# EAGLE schematic serv_open8_tsmc (EAGLE 9.6.2)
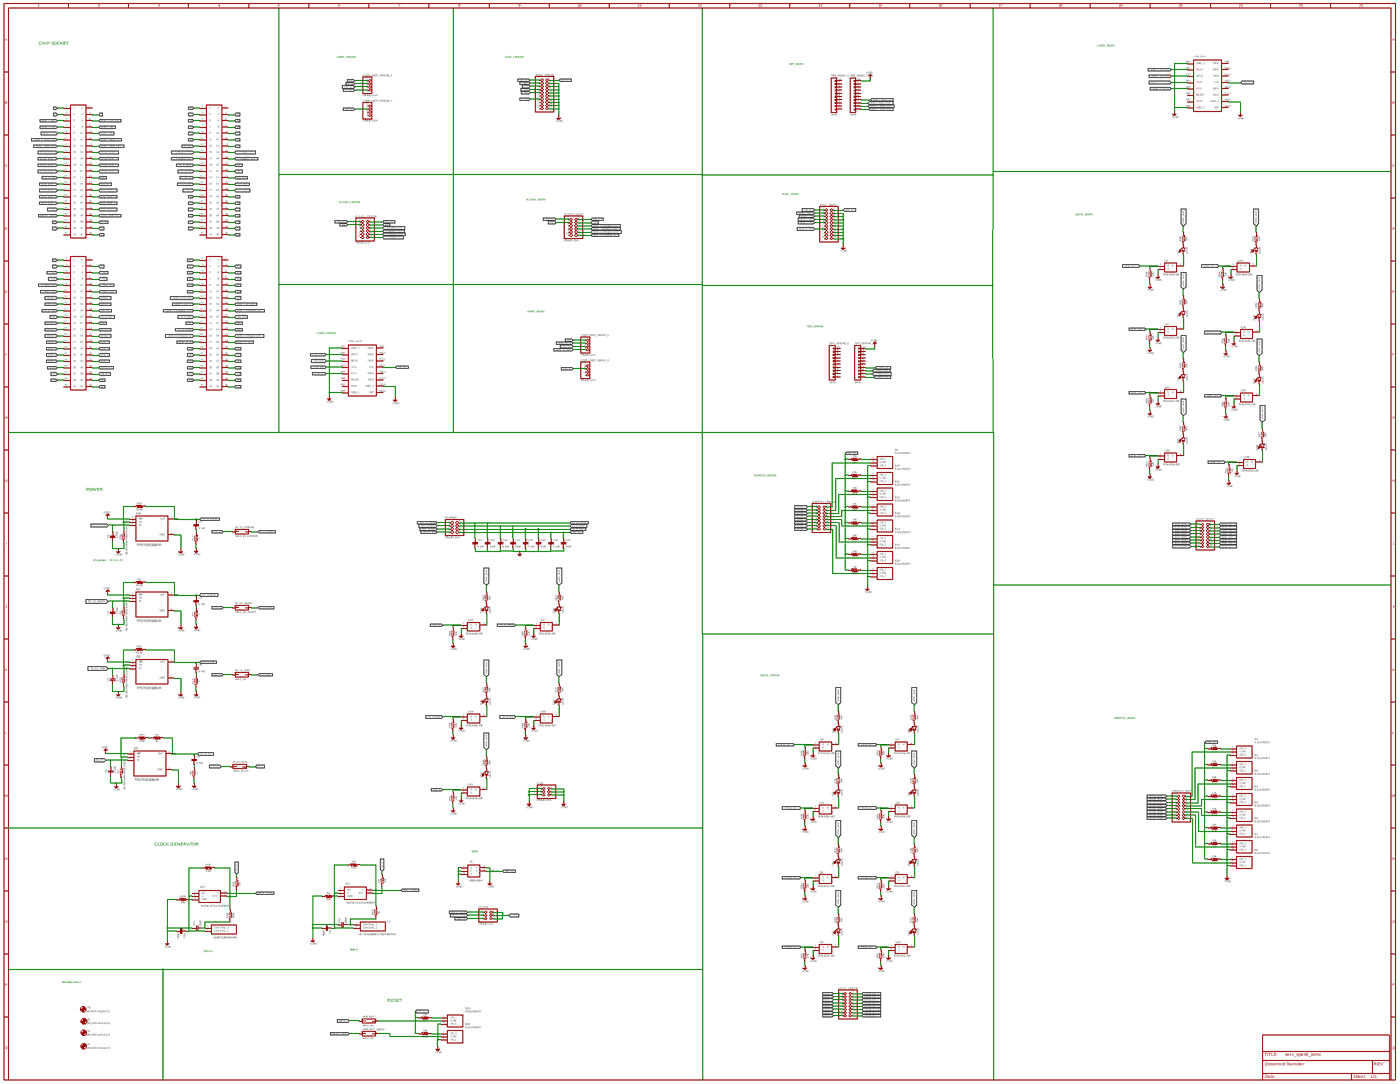
[diagram p0: schematic, sheet 1, overview]
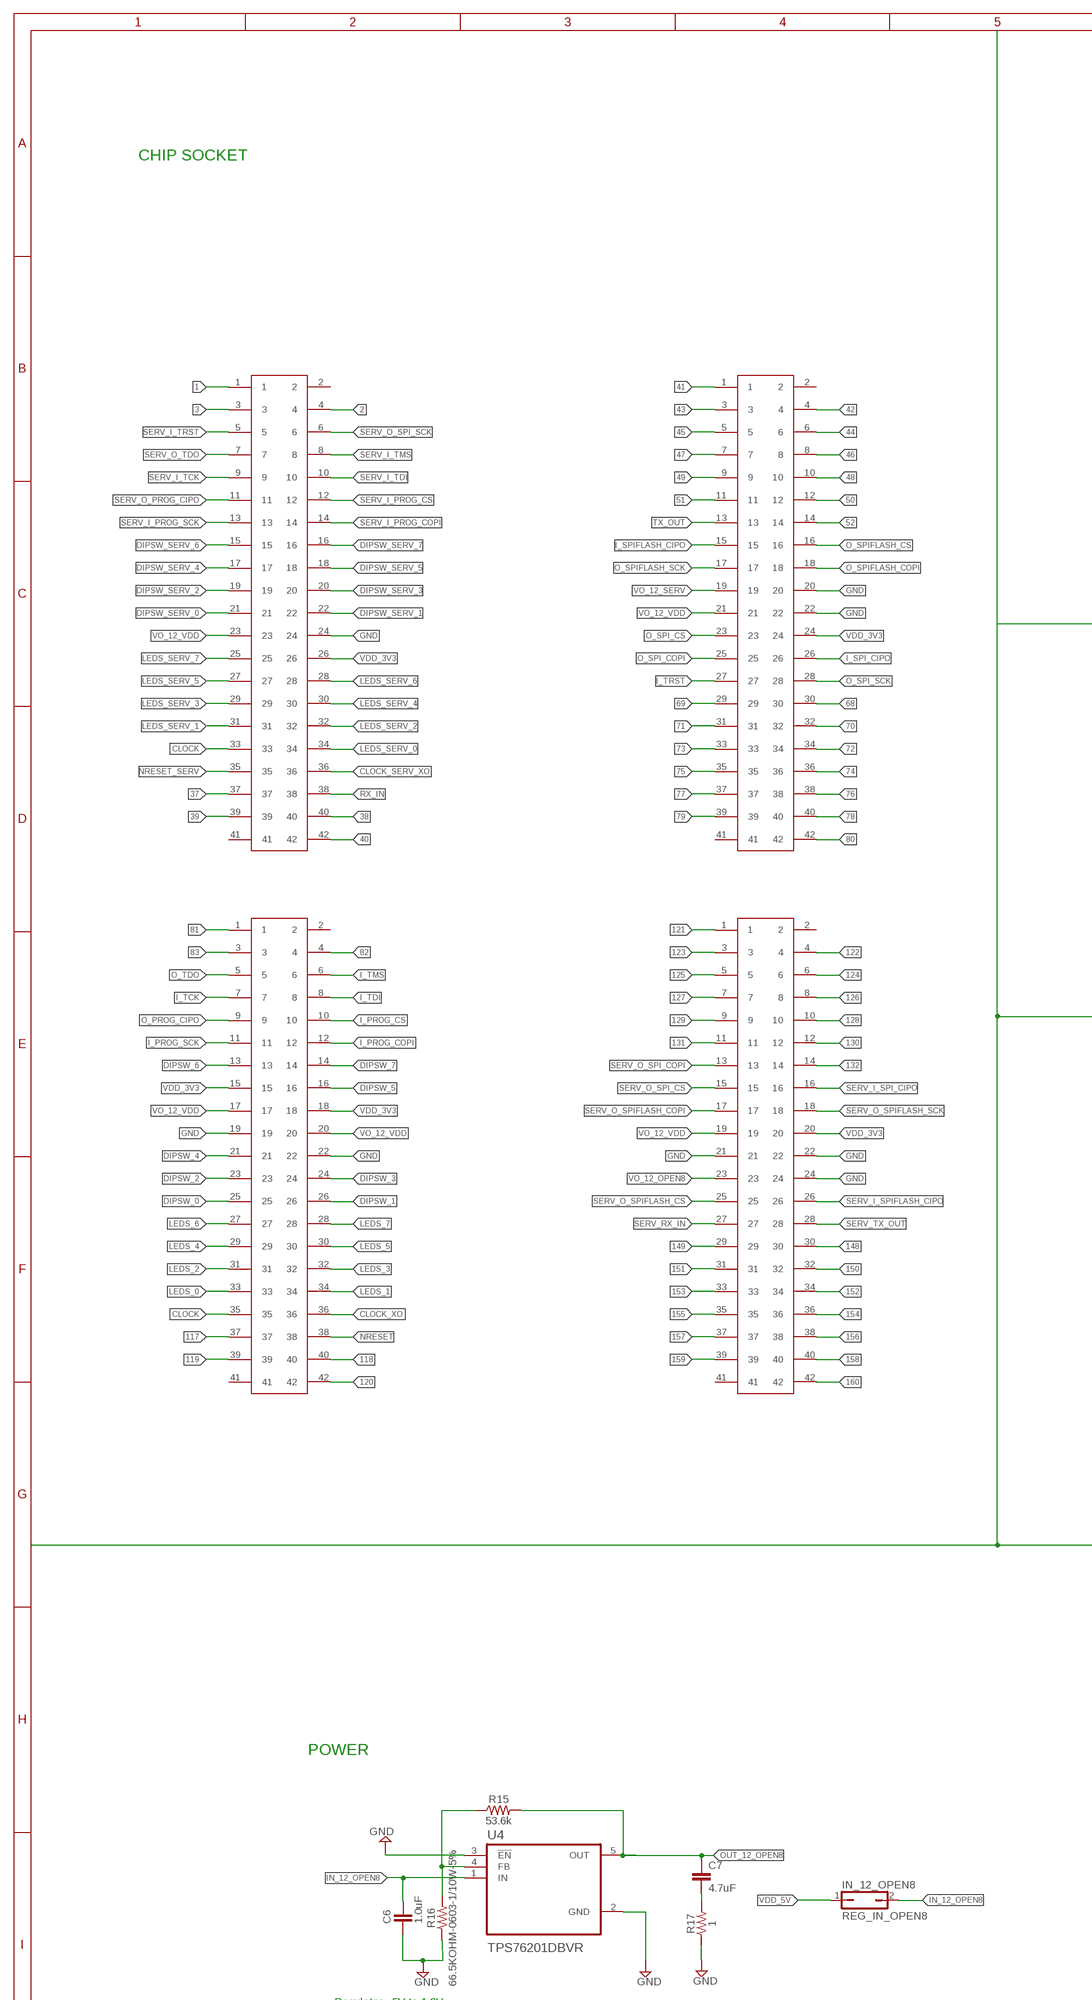
[diagram p1: schematic, sheet 1, part 1 of 8]
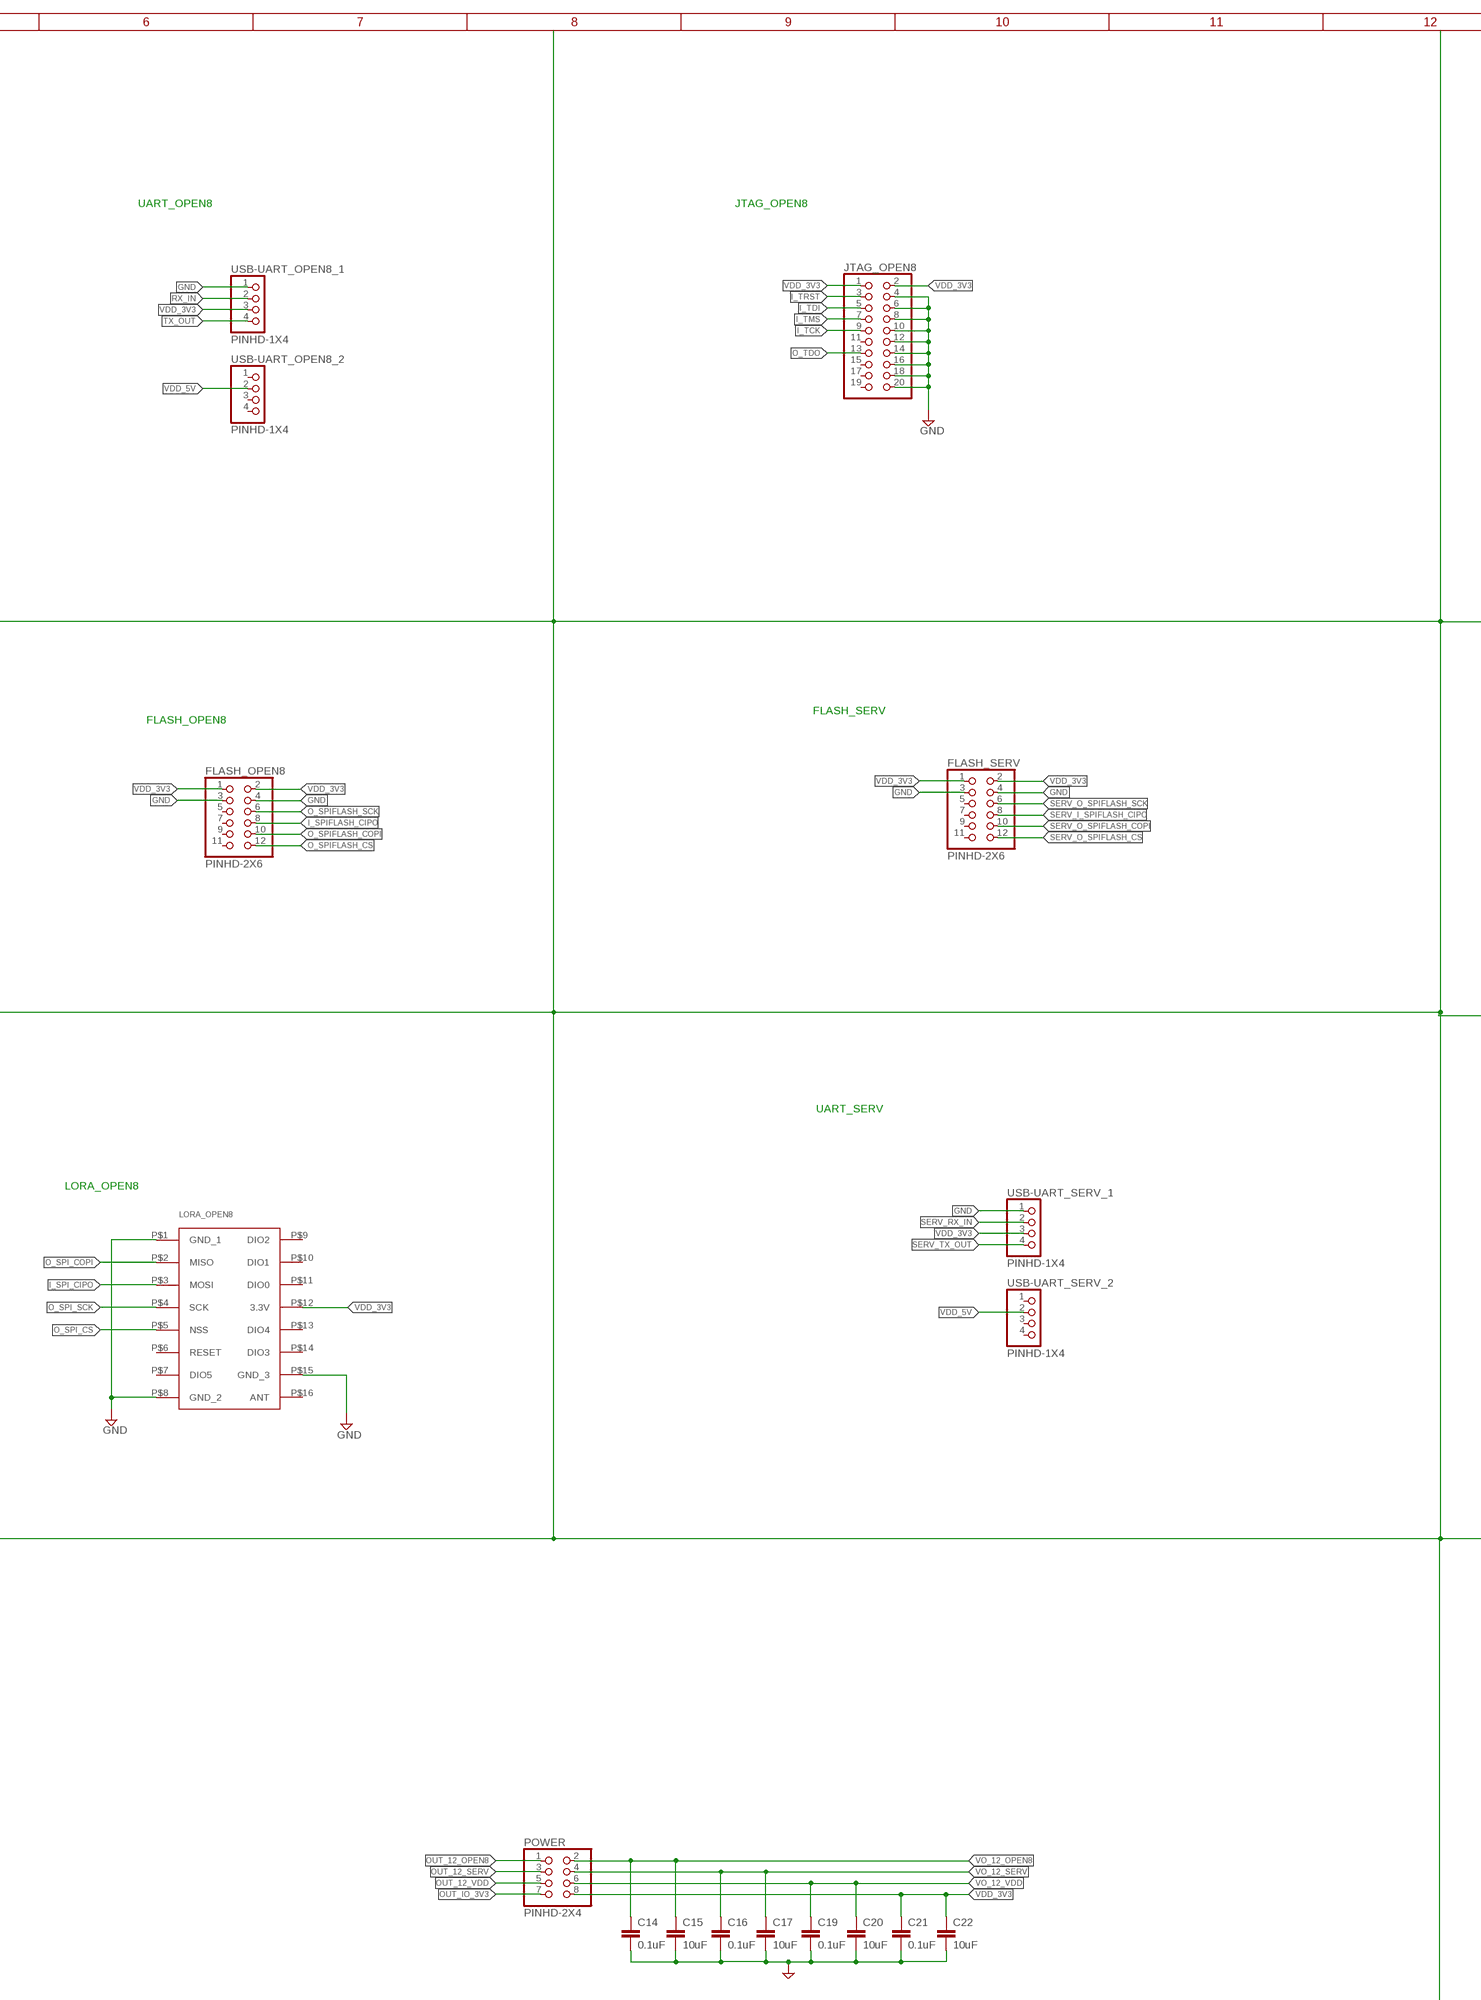
[diagram p2: schematic, sheet 1, part 2 of 8]
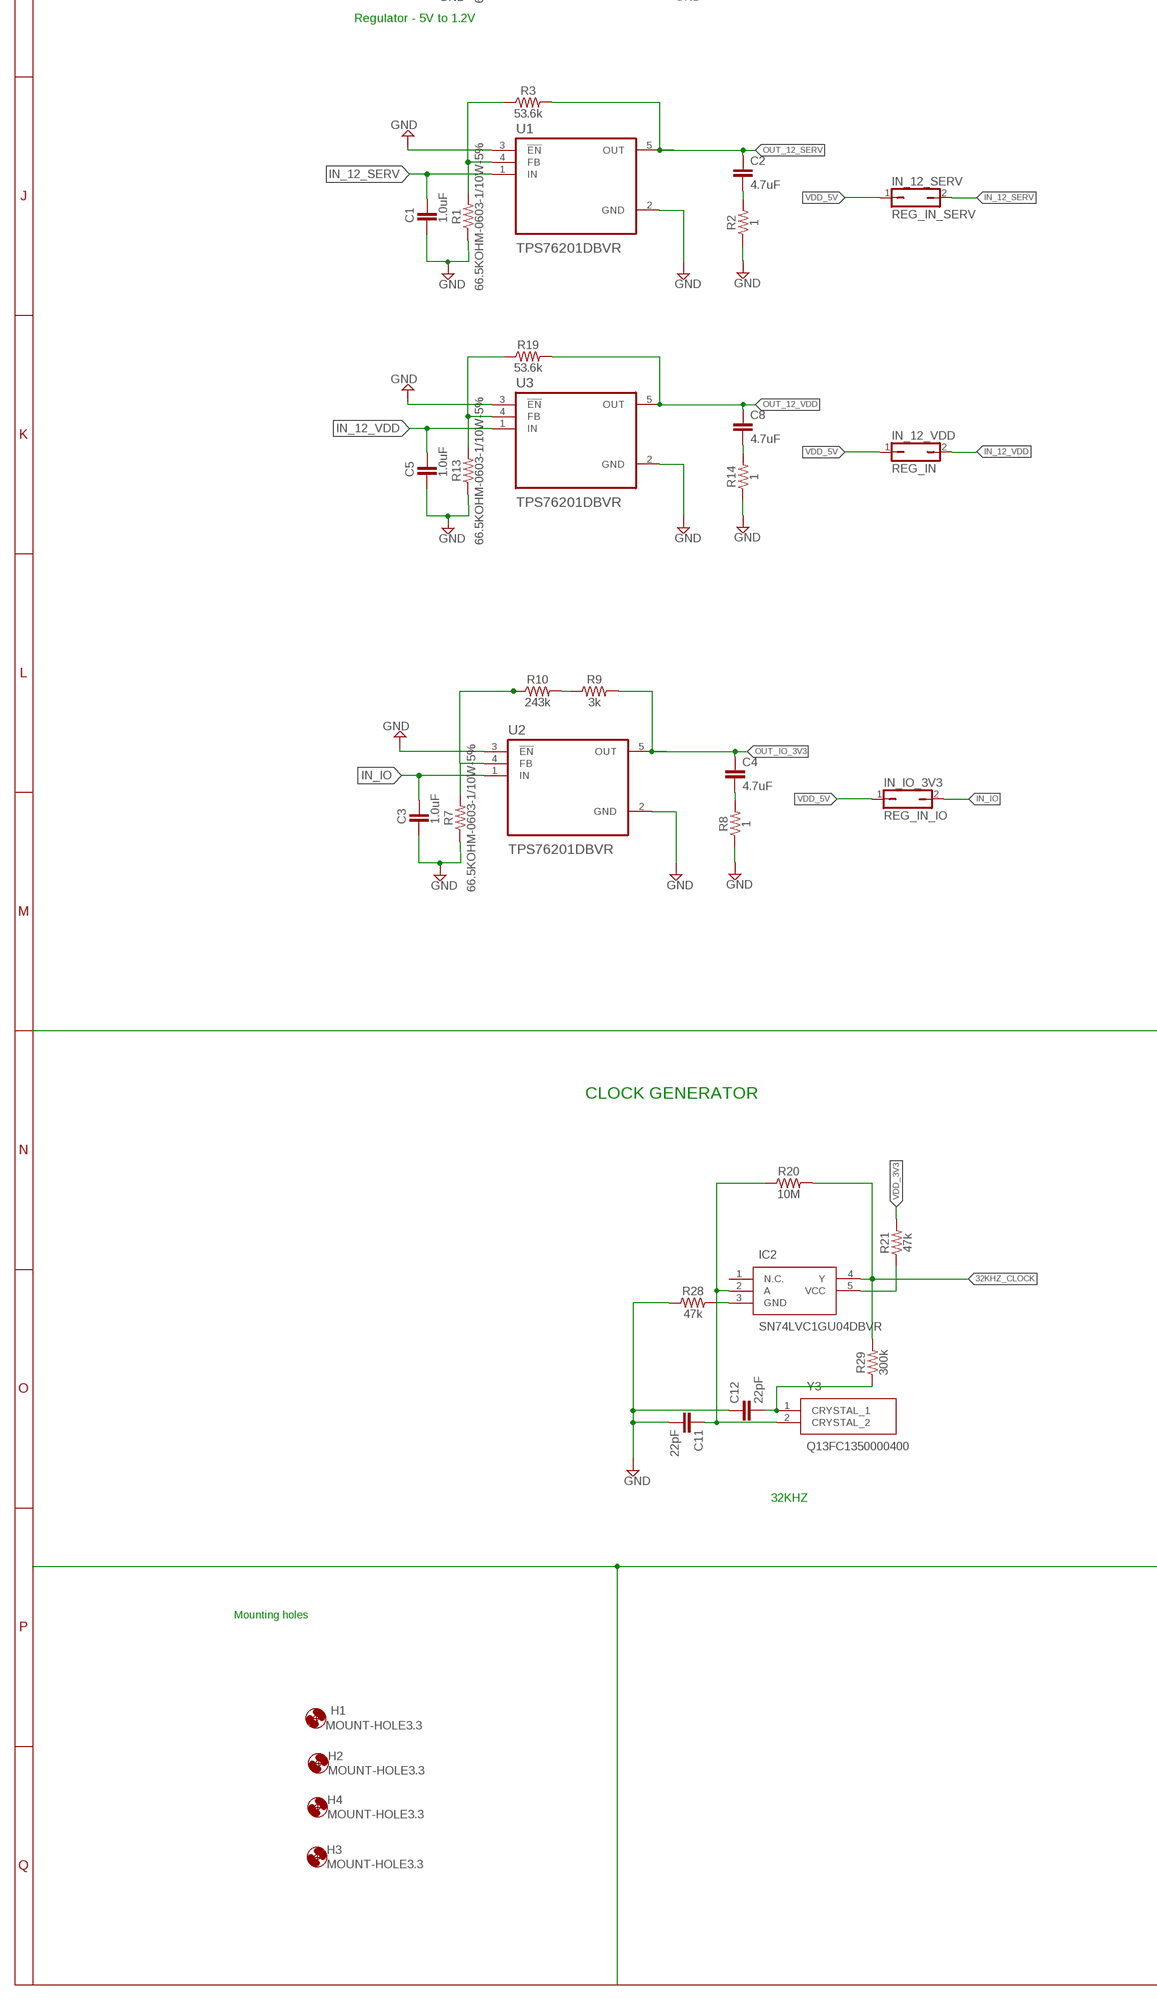
[diagram p3: schematic, sheet 1, part 3 of 8]
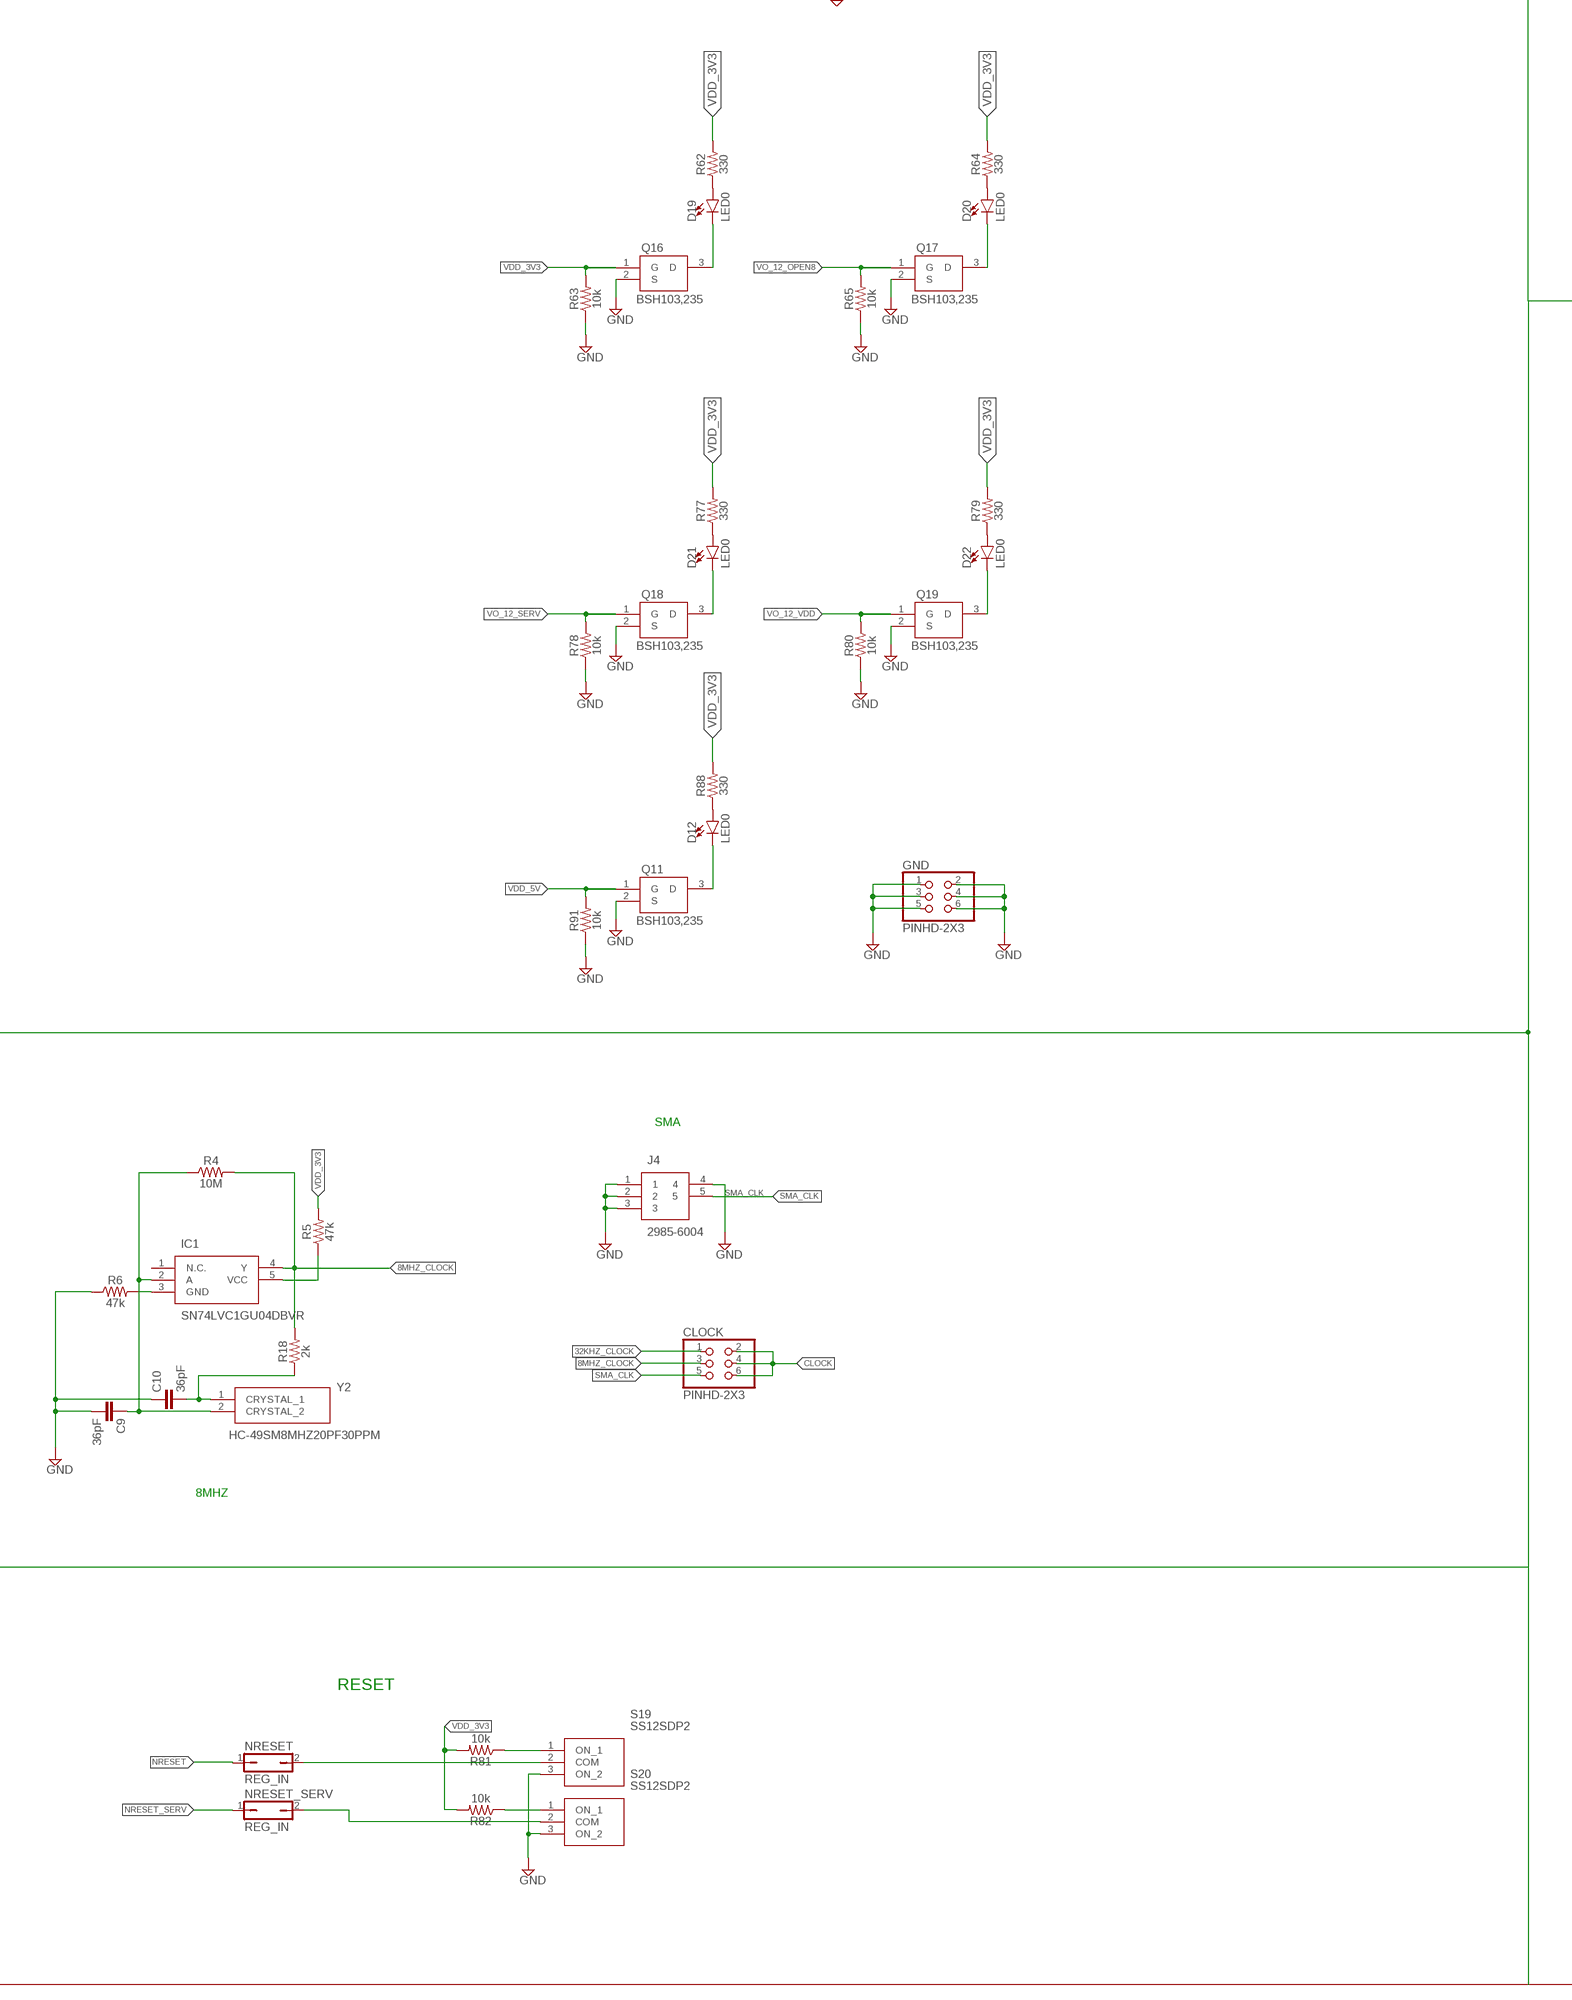
[diagram p4: schematic, sheet 1, part 4 of 8]
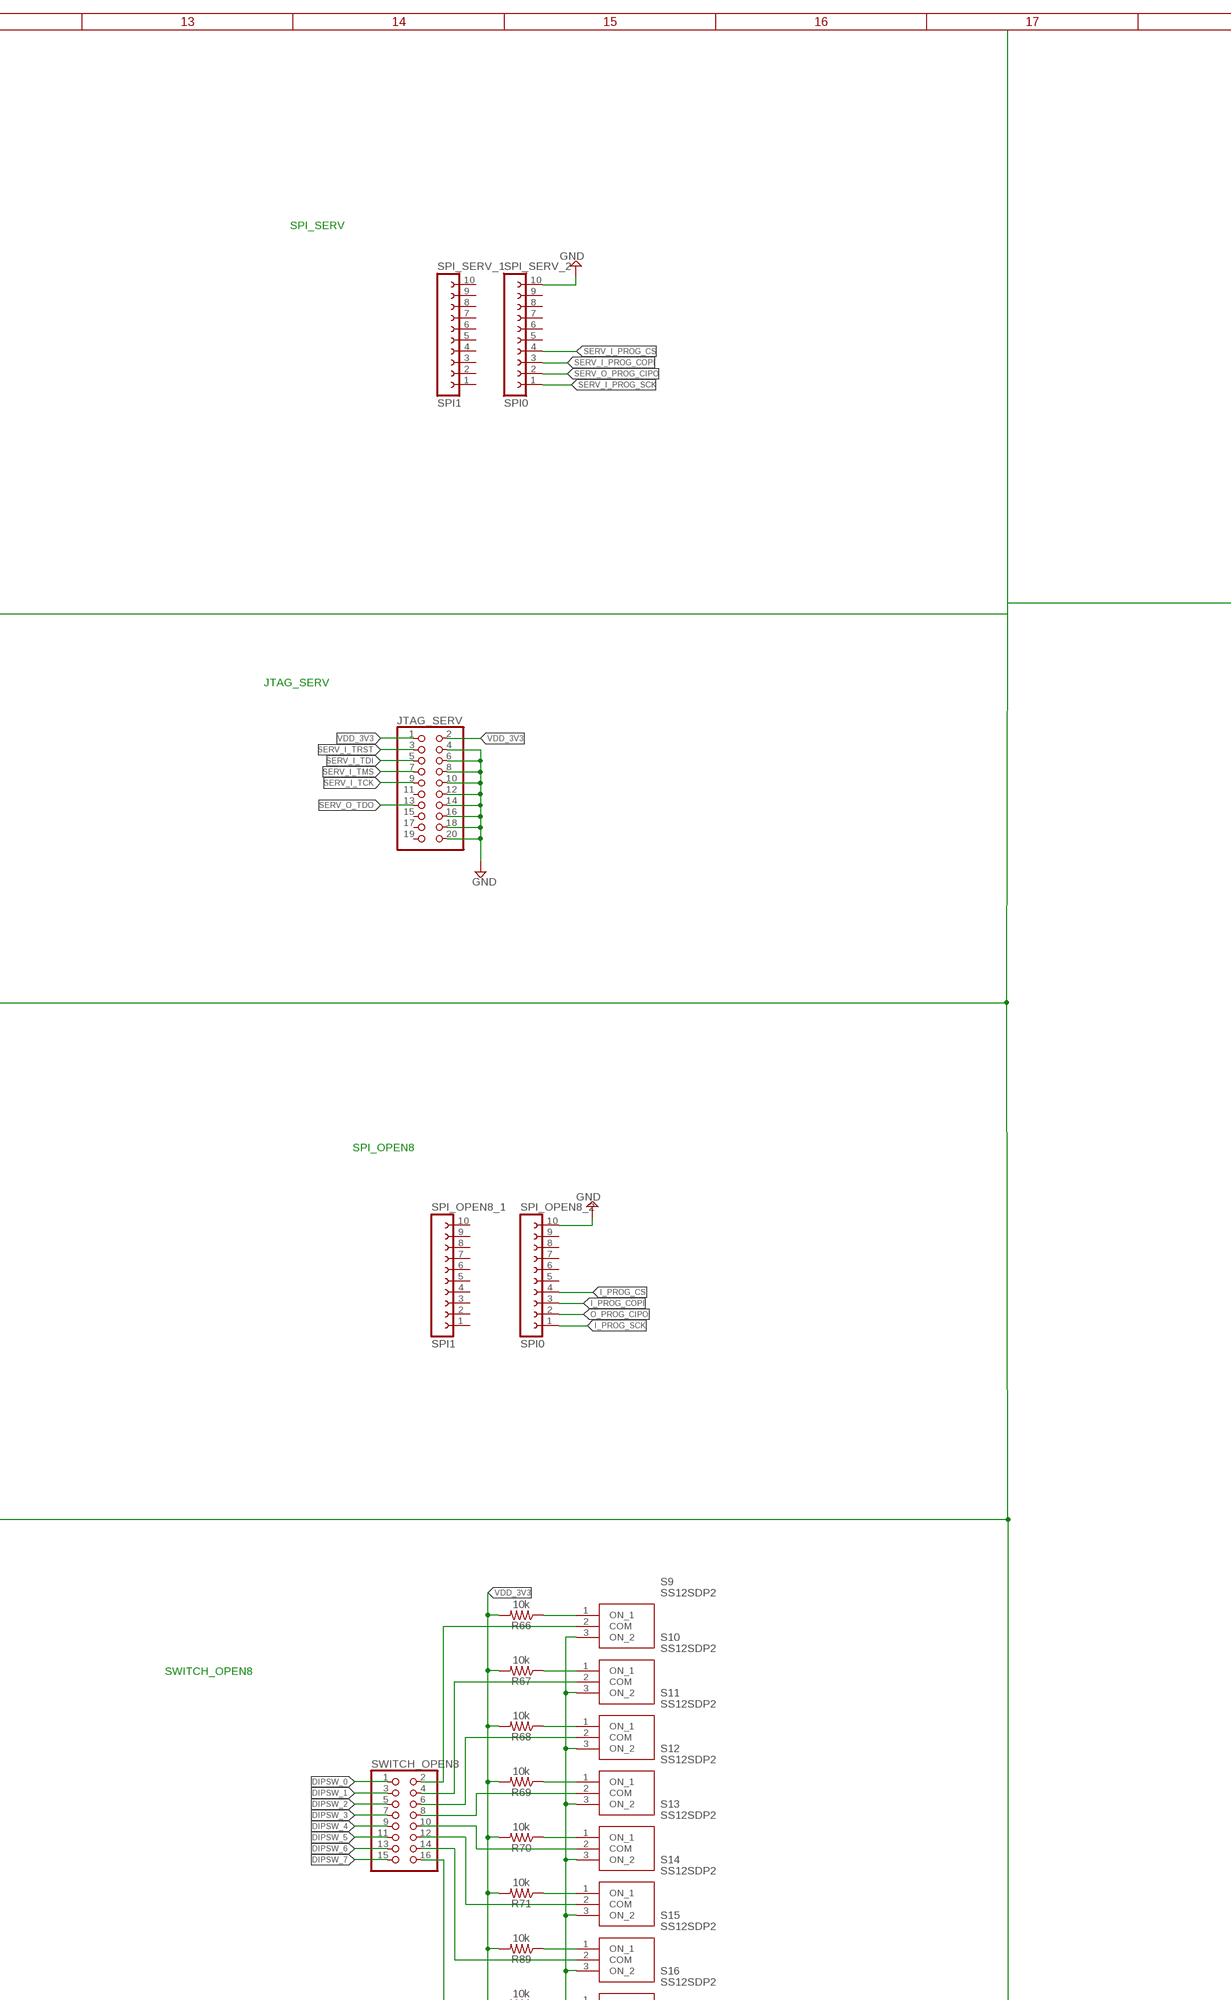
[diagram p5: schematic, sheet 1, part 5 of 8]
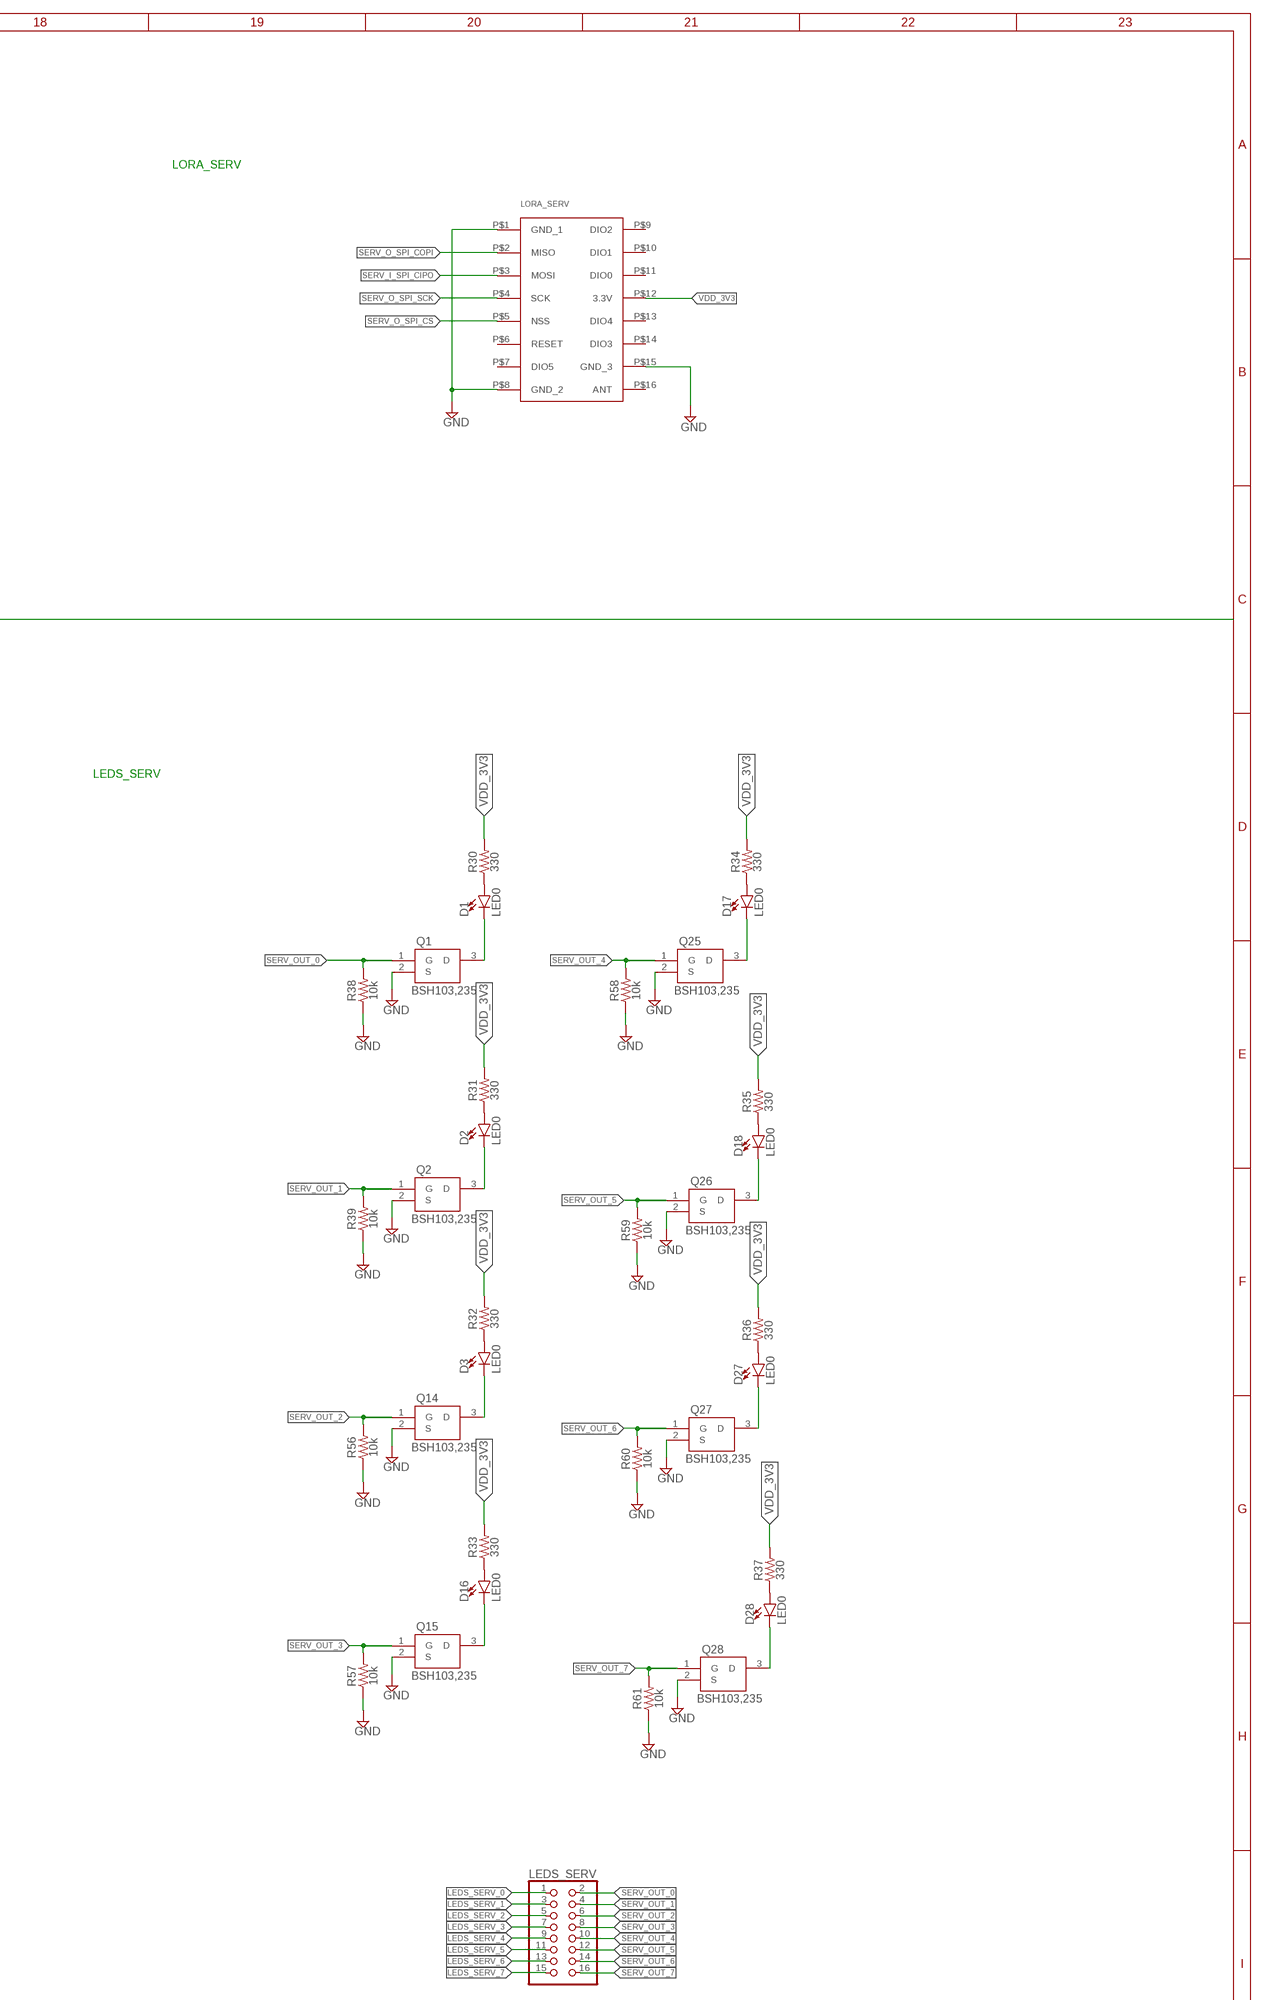
[diagram p6: schematic, sheet 1, part 6 of 8]
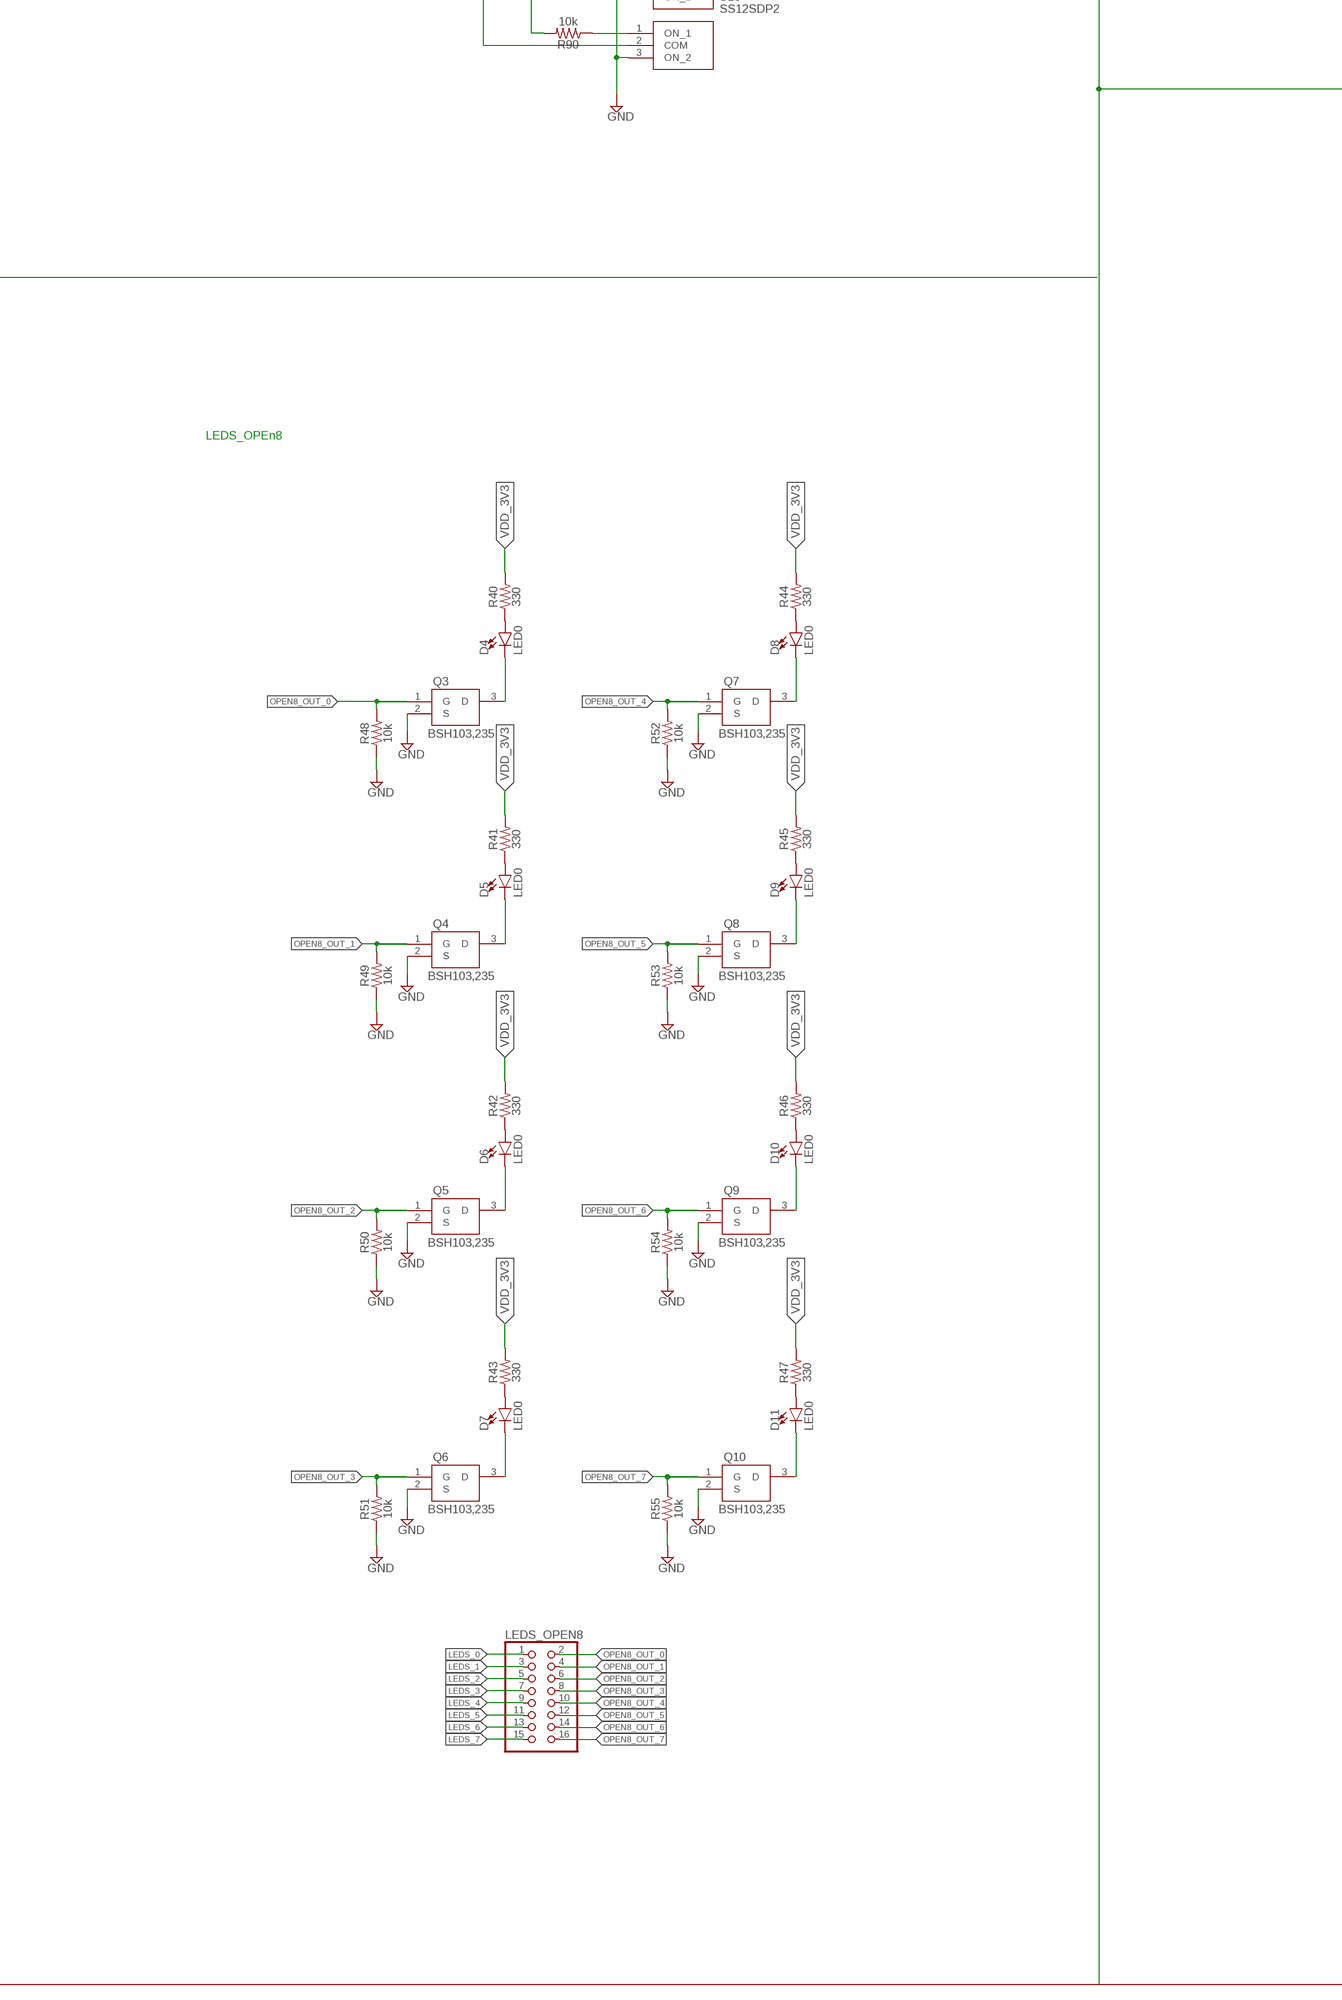
[diagram p7: schematic, sheet 1, part 7 of 8]
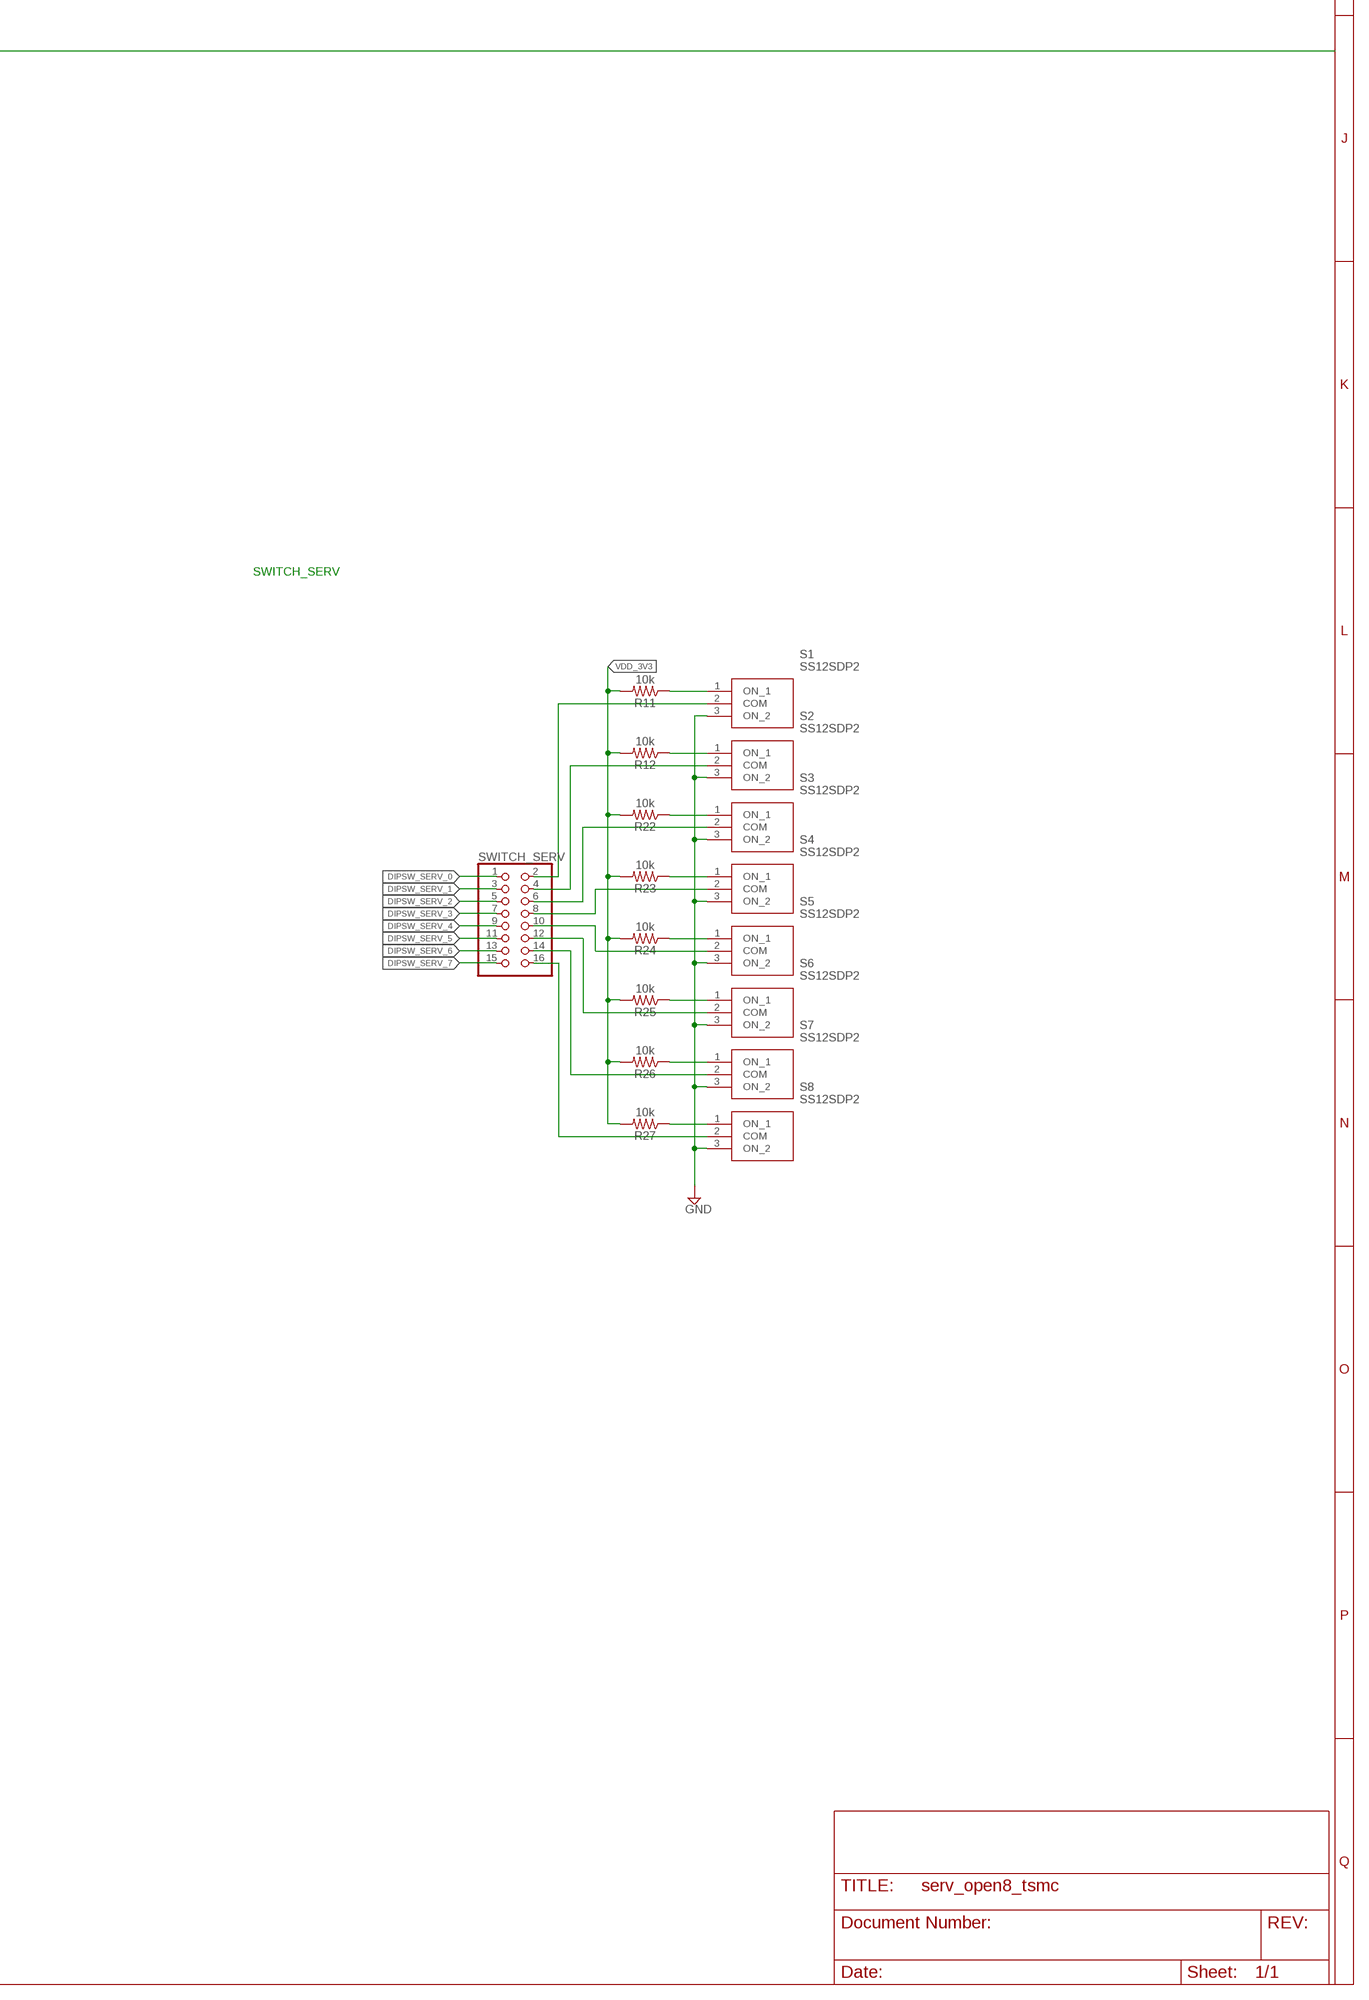
[diagram p8: schematic, sheet 1, part 8 of 8]

## Parts
C1  1.0uF  1.0UF-0603-16V-10%  [0603]
C2  4.7uF  4.7UF0603  [0603]
C3  1.0uF  1.0UF-0603-16V-10%  [0603]
C4  4.7uF  4.7UF0603  [0603]
C5  1.0uF  1.0UF-0603-16V-10%  [0603]
C6  1.0uF  1.0UF-0603-16V-10%  [0603]
C7  4.7uF  4.7UF0603  [0603]
C8  4.7uF  4.7UF0603  [0603]
C9  36pF  22PF-0603-50V-5%  [0603]
C10  36pF  22PF-0603-50V-5%  [0603]
C11  22pF  22PF-0603-50V-5%  [0603]
C12  22pF  22PF-0603-50V-5%  [0603]
C14  0.1uF  0.1UF-0603-25V-5%  [0603]
C15  10uF  10UF-0603-6.3V-20%  [0603]
C16  0.1uF  0.1UF-0603-25V-5%  [0603]
C17  10uF  10UF-0603-6.3V-20%  [0603]
C19  0.1uF  0.1UF-0603-25V-5%  [0603]
C20  10uF  10UF-0603-6.3V-20%  [0603]
C21  0.1uF  0.1UF-0603-25V-5%  [0603]
C22  10uF  10UF-0603-6.3V-20%  [0603]
CLOCK  PINHD-2X3  [2X03]
D1  LED0  LED0603  [LED-0603]
D2  LED0  LED0603  [LED-0603]
D3  LED0  LED0603  [LED-0603]
D4  LED0  LED0603  [LED-0603]
D5  LED0  LED0603  [LED-0603]
D6  LED0  LED0603  [LED-0603]
D7  LED0  LED0603  [LED-0603]
D8  LED0  LED0603  [LED-0603]
D9  LED0  LED0603  [LED-0603]
D10  LED0  LED0603  [LED-0603]
D11  LED0  LED0603  [LED-0603]
D12  LED0  LED0603  [LED-0603]
D16  LED0  LED0603  [LED-0603]
D17  LED0  LED0603  [LED-0603]
D18  LED0  LED0603  [LED-0603]
D19  LED0  LED0603  [LED-0603]
D20  LED0  LED0603  [LED-0603]
D21  LED0  LED0603  [LED-0603]
D22  LED0  LED0603  [LED-0603]
D27  LED0  LED0603  [LED-0603]
D28  LED0  LED0603  [LED-0603]
FLASH_OPEN8  PINHD-2X6  [2X06]
FLASH_SERV  PINHD-2X6  [2X06]
GND  PINHD-2X3  [2X03]
H1  MOUNT-HOLE3.3  [3,3]
H2  MOUNT-HOLE3.3  [3,3]
H3  MOUNT-HOLE3.3  [3,3]
H4  MOUNT-HOLE3.3  [3,3]
IC1  SN74LVC1GU04DBVR  [SOT95P280X145-5N]
IC2  SN74LVC1GU04DBVR  [SOT95P280X145-5N]
IN_12_OPEN8  REG_IN_OPEN8  JP1Q  [JP1]
IN_12_SERV  REG_IN_SERV  JP1Q  [JP1]
IN_12_VDD  REG_IN  JP1Q  [JP1]
IN_IO_3V3  REG_IN_IO  JP1Q  [JP1]
J4  2985-6004  [29856004]
JTAG_OPEN8  PINHD-2X10  [2X10]
JTAG_SERV  PINHD-2X10  [2X10]
LEDS_OPEN8  PINHD-2X8  [2X08]
LEDS_SERV  PINHD-2X8  [2X08]
LORA_OPEN8  RFM95W-915S2  [RFM95-915S2]
LORA_SERV  RFM95W-915S2  [RFM95-915S2]
NRESET  REG_IN  JP1Q  [JP1]
NRESET_SERV  REG_IN  JP1Q  [JP1]
POWER  PINHD-2X4  [2X04]
Q1  BSH103,235  [SOT95P230X110-3N]
Q2  BSH103,235  [SOT95P230X110-3N]
Q3  BSH103,235  [SOT95P230X110-3N]
Q4  BSH103,235  [SOT95P230X110-3N]
Q5  BSH103,235  [SOT95P230X110-3N]
Q6  BSH103,235  [SOT95P230X110-3N]
Q7  BSH103,235  [SOT95P230X110-3N]
Q8  BSH103,235  [SOT95P230X110-3N]
Q9  BSH103,235  [SOT95P230X110-3N]
Q10  BSH103,235  [SOT95P230X110-3N]
Q11  BSH103,235  [SOT95P230X110-3N]
Q14  BSH103,235  [SOT95P230X110-3N]
Q15  BSH103,235  [SOT95P230X110-3N]
Q16  BSH103,235  [SOT95P230X110-3N]
Q17  BSH103,235  [SOT95P230X110-3N]
Q18  BSH103,235  [SOT95P230X110-3N]
Q19  BSH103,235  [SOT95P230X110-3N]
Q25  BSH103,235  [SOT95P230X110-3N]
Q26  BSH103,235  [SOT95P230X110-3N]
Q27  BSH103,235  [SOT95P230X110-3N]
Q28  BSH103,235  [SOT95P230X110-3N]
R1  66.5KOHM-0603-1/10W-5%  62KOHM-0603-1/10W-5%  [0603]
R2  1  1OHM-0603-1/10W-1%  [0603]
R3  53.6k  43KOHM-0603-1/10W-1%  [0603]
R4  10M  22MOHM-0603-1/10W-10%  [0603]
R5  47k  22MOHM-0603-1/10W-10%  [0603]
R6  47k  22MOHM-0603-1/10W-10%  [0603]
R7  66.5KOHM-0603-1/10W-5%  62KOHM-0603-1/10W-5%  [0603]
R8  1  1OHM-0603-1/10W-1%  [0603]
R9  3k  26.7KOHM0603-1/10W-1%  [0603]
R10  243k  220KOHM-0603-1/10W-1%  [0603]
R11  10k  10KOHM-0603-1/10W-1%  [0603]
R12  10k  10KOHM-0603-1/10W-1%  [0603]
R13  66.5KOHM-0603-1/10W-5%  62KOHM-0603-1/10W-5%  [0603]
R14  1  1OHM-0603-1/10W-1%  [0603]
R15  53.6k  43KOHM-0603-1/10W-1%  [0603]
R16  66.5KOHM-0603-1/10W-5%  62KOHM-0603-1/10W-5%  [0603]
R17  1  1OHM-0603-1/10W-1%  [0603]
R18  2k  22MOHM-0603-1/10W-10%  [0603]
R19  53.6k  43KOHM-0603-1/10W-1%  [0603]
R20  10M  22MOHM-0603-1/10W-10%  [0603]
R21  47k  22MOHM-0603-1/10W-10%  [0603]
R22  10k  10KOHM-0603-1/10W-1%  [0603]
R23  10k  10KOHM-0603-1/10W-1%  [0603]
R24  10k  10KOHM-0603-1/10W-1%  [0603]
R25  10k  10KOHM-0603-1/10W-1%  [0603]
R26  10k  10KOHM-0603-1/10W-1%  [0603]
R27  10k  10KOHM-0603-1/10W-1%  [0603]
R28  47k  22MOHM-0603-1/10W-10%  [0603]
R29  300k  22MOHM-0603-1/10W-10%  [0603]
R30  330  330OHM-0603-1/10W-1%  [0603]
R31  330  330OHM-0603-1/10W-1%  [0603]
R32  330  330OHM-0603-1/10W-1%  [0603]
R33  330  330OHM-0603-1/10W-1%  [0603]
R34  330  330OHM-0603-1/10W-1%  [0603]
R35  330  330OHM-0603-1/10W-1%  [0603]
R36  330  330OHM-0603-1/10W-1%  [0603]
R37  330  330OHM-0603-1/10W-1%  [0603]
R38  10k  10KOHM-0603-1/10W-1%  [0603]
R39  10k  10KOHM-0603-1/10W-1%  [0603]
R40  330  330OHM-0603-1/10W-1%  [0603]
R41  330  330OHM-0603-1/10W-1%  [0603]
R42  330  330OHM-0603-1/10W-1%  [0603]
R43  330  330OHM-0603-1/10W-1%  [0603]
R44  330  330OHM-0603-1/10W-1%  [0603]
R45  330  330OHM-0603-1/10W-1%  [0603]
R46  330  330OHM-0603-1/10W-1%  [0603]
R47  330  330OHM-0603-1/10W-1%  [0603]
R48  10k  10KOHM-0603-1/10W-1%  [0603]
R49  10k  10KOHM-0603-1/10W-1%  [0603]
R50  10k  10KOHM-0603-1/10W-1%  [0603]
R51  10k  10KOHM-0603-1/10W-1%  [0603]
R52  10k  10KOHM-0603-1/10W-1%  [0603]
R53  10k  10KOHM-0603-1/10W-1%  [0603]
R54  10k  10KOHM-0603-1/10W-1%  [0603]
R55  10k  10KOHM-0603-1/10W-1%  [0603]
R56  10k  10KOHM-0603-1/10W-1%  [0603]
R57  10k  10KOHM-0603-1/10W-1%  [0603]
R58  10k  10KOHM-0603-1/10W-1%  [0603]
R59  10k  10KOHM-0603-1/10W-1%  [0603]
R60  10k  10KOHM-0603-1/10W-1%  [0603]
R61  10k  10KOHM-0603-1/10W-1%  [0603]
R62  330  330OHM-0603-1/10W-1%  [0603]
R63  10k  10KOHM-0603-1/10W-1%  [0603]
R64  330  330OHM-0603-1/10W-1%  [0603]
R65  10k  10KOHM-0603-1/10W-1%  [0603]
R66  10k  10KOHM-0603-1/10W-1%  [0603]
R67  10k  10KOHM-0603-1/10W-1%  [0603]
R68  10k  10KOHM-0603-1/10W-1%  [0603]
R69  10k  10KOHM-0603-1/10W-1%  [0603]
R70  10k  10KOHM-0603-1/10W-1%  [0603]
R71  10k  10KOHM-0603-1/10W-1%  [0603]
R77  330  330OHM-0603-1/10W-1%  [0603]
R78  10k  10KOHM-0603-1/10W-1%  [0603]
R79  330  330OHM-0603-1/10W-1%  [0603]
R80  10k  10KOHM-0603-1/10W-1%  [0603]
R81  10k  10KOHM-0603-1/10W-1%  [0603]
R82  10k  10KOHM-0603-1/10W-1%  [0603]
R88  330  330OHM-0603-1/10W-1%  [0603]
R89  10k  10KOHM-0603-1/10W-1%  [0603]
R90  10k  10KOHM-0603-1/10W-1%  [0603]
R91  10k  10KOHM-0603-1/10W-1%  [0603]
S1  SS12SDP2  [SS12SDP2]
S2  SS12SDP2  [SS12SDP2]
S3  SS12SDP2  [SS12SDP2]
S4  SS12SDP2  [SS12SDP2]
S5  SS12SDP2  [SS12SDP2]
S6  SS12SDP2  [SS12SDP2]
S7  SS12SDP2  [SS12SDP2]
S8  SS12SDP2  [SS12SDP2]
S9  SS12SDP2  [SS12SDP2]
S10  SS12SDP2  [SS12SDP2]
S11  SS12SDP2  [SS12SDP2]
S12  SS12SDP2  [SS12SDP2]
S13  SS12SDP2  [SS12SDP2]
S14  SS12SDP2  [SS12SDP2]
S15  SS12SDP2  [SS12SDP2]
S16  SS12SDP2  [SS12SDP2]
S19  SS12SDP2  [SS12SDP2]
S20  SS12SDP2  [SS12SDP2]
SPI_OPEN8_1  SPI1  FE10-1  [FE10]
SPI_OPEN8_2  SPI0  FE10-1  [FE10]
SPI_SERV_1  SPI1  FE10-1  [FE10]
SPI_SERV_2  SPI0  FE10-1  [FE10]
SWITCH_OPEN8  PINHD-2X8  [2X08]
SWITCH_SERV  PINHD-2X8  [2X08]
U1  TPS76201DBVR  [SOT95P280X145-5N]
U2  TPS76201DBVR  [SOT95P280X145-5N]
U3  TPS76201DBVR  [SOT95P280X145-5N]
U4  TPS76201DBVR  [SOT95P280X145-5N]
U$1  2X41_HEADER  [2X41_HEADER]
U$2  2X41_HEADER  [2X41_HEADER]
U$3  2X41_HEADER  [2X41_HEADER]
U$4  2X41_HEADER  [2X41_HEADER]
USB-UART_OPEN8_1  PINHD-1X4  [1X04]
USB-UART_OPEN8_2  PINHD-1X4  [1X04]
USB-UART_SERV_1  PINHD-1X4  [1X04]
USB-UART_SERV_2  PINHD-1X4  [1X04]
Y2  HC-49SM8MHZ20PF30PPM  [HC49SM8MHZ20PF30PPM]
Y3  Q13FC1350000400  [Q13FC1350000400]

## Nets
1: U$1.1
2: U$1.4
3: U$1.3
8MHZ_CLOCK: CLOCK.3 IC1.4(Y) R4.2 R18.2
32KHZ_CLOCK: CLOCK.1 IC2.4(Y) R20.2 R29.2
37: U$1.37
38: U$1.40
39: U$1.39
40: U$1.42
41: U$2.1
42: U$2.4
43: U$2.3
44: U$2.6
45: U$2.5
46: U$2.8
47: U$2.7
48: U$2.10
49: U$2.9
50: U$2.12
51: U$2.11
52: U$2.14
68: U$2.30
69: U$2.29
70: U$2.32
71: U$2.31
72: U$2.34
73: U$2.33
74: U$2.36
75: U$2.35
76: U$2.38
77: U$2.37
78: U$2.40
79: U$2.39
80: U$2.42
81: U$3.1
82: U$3.4
83: U$3.3
117: U$3.37
118: U$3.40
119: U$3.39
120: U$3.42
121: U$4.1
122: U$4.4
123: U$4.3
124: U$4.6
125: U$4.5
126: U$4.8
127: U$4.7
128: U$4.10
129: U$4.9
130: U$4.12
131: U$4.11
132: U$4.14
148: U$4.30
149: U$4.29
150: U$4.32
151: U$4.31
152: U$4.34
153: U$4.33
154: U$4.36
155: U$4.35
156: U$4.38
157: U$4.37
158: U$4.40
159: U$4.39
160: U$4.42
CLOCK: CLOCK.2 CLOCK.4 CLOCK.6 U$1.33 U$3.35
CLOCK_SERV_XO: U$1.36
CLOCK_XO: U$3.36
DIPSW_0: SWITCH_OPEN8.1 U$3.25
DIPSW_1: SWITCH_OPEN8.3 U$3.26
DIPSW_2: SWITCH_OPEN8.5 U$3.23
DIPSW_3: SWITCH_OPEN8.7 U$3.24
DIPSW_4: SWITCH_OPEN8.9 U$3.21
DIPSW_5: SWITCH_OPEN8.11 U$3.16
DIPSW_6: SWITCH_OPEN8.13 U$3.13
DIPSW_7: SWITCH_OPEN8.15 U$3.14
DIPSW_SERV_0: SWITCH_SERV.1 U$1.21
DIPSW_SERV_1: SWITCH_SERV.3 U$1.22
DIPSW_SERV_2: SWITCH_SERV.5 U$1.19
DIPSW_SERV_3: SWITCH_SERV.7 U$1.20
DIPSW_SERV_4: SWITCH_SERV.9 U$1.17
DIPSW_SERV_5: SWITCH_SERV.11 U$1.18
DIPSW_SERV_6: SWITCH_SERV.13 U$1.15
DIPSW_SERV_7: SWITCH_SERV.15 U$1.16
GND: C1.2 C3.2 C5.2 C6.2 C9.2 C10.1 C11.2 C12.1 C14.2 C15.2 C16.2 C17.2 C19.2 C20.2 C21.2 C22.2 FLASH_OPEN8.3 FLASH_OPEN8.4 FLASH_SERV.3 FLASH_SERV.4 GND.1 GND.2 GND.3 GND.4 GND.5 GND.6 J4.1 J4.2 J4.3 J4.4 JTAG_OPEN8.4 JTAG_OPEN8.6 JTAG_OPEN8.8 JTAG_OPEN8.10 JTAG_OPEN8.12 JTAG_OPEN8.14 JTAG_OPEN8.16 JTAG_OPEN8.18 JTAG_OPEN8.20 JTAG_SERV.4 JTAG_SERV.6 JTAG_SERV.8 JTAG_SERV.10 JTAG_SERV.12 JTAG_SERV.14 JTAG_SERV.16 JTAG_SERV.18 JTAG_SERV.20 LORA_OPEN8.P$1(GND_1) LORA_OPEN8.P$8(GND_2) LORA_OPEN8.P$15(GND_3) LORA_SERV.P$1(GND_1) LORA_SERV.P$8(GND_2) LORA_SERV.P$15(GND_3) Q1.2(S) Q2.2(S) Q3.2(S) Q4.2(S) Q5.2(S) Q6.2(S) Q7.2(S) Q8.2(S) Q9.2(S) Q10.2(S) Q11.2(S) Q14.2(S) Q15.2(S) Q16.2(S) Q17.2(S) Q18.2(S) Q19.2(S) Q25.2(S) Q26.2(S) Q27.2(S) Q28.2(S) R1.1 R2.1 R6.1 R7.1 R8.1 R13.1 R14.1 R16.1 R17.1 R28.1 R38.1 R39.1 R48.1 R49.1 R50.1 R51.1 R52.1 R53.1 R54.1 R55.1 R56.1 R57.1 R58.1 R59.1 R60.1 R61.1 R63.1 R65.1 R78.1 R80.1 R91.1 S1.3(ON_2) S2.3(ON_2) S3.3(ON_2) S4.3(ON_2) S5.3(ON_2) S6.3(ON_2) S7.3(ON_2) S8.3(ON_2) S9.3(ON_2) S10.3(ON_2) S11.3(ON_2) S12.3(ON_2) S13.3(ON_2) S14.3(ON_2) S15.3(ON_2) S16.3(ON_2) S19.3(ON_2) S20.3(ON_2) SPI_OPEN8_2.10 SPI_SERV_2.10 U1.2(GND) U1.3(!EN) U2.2(GND) U2.3(!EN) U3.2(GND) U3.3(!EN) U4.2(GND) U4.3(!EN) U$1.24 U$2.20 U$2.22 U$3.19 U$3.22 U$4.21 U$4.22 U$4.24 USB-UART_OPEN8_1.1 USB-UART_SERV_1.1
I_PROG_COPI: SPI_OPEN8_2.3 U$3.12
I_PROG_CS: SPI_OPEN8_2.4 U$3.10
I_PROG_SCK: SPI_OPEN8_2.1 U$3.11
I_SPI_CIPO: LORA_OPEN8.P$3(MOSI) U$2.26
I_SPIFLASH_CIPO: FLASH_OPEN8.8 U$2.15
I_TCK: JTAG_OPEN8.9 U$3.7
I_TDI: JTAG_OPEN8.5 U$3.8
I_TMS: JTAG_OPEN8.7 U$3.6
I_TRST: JTAG_OPEN8.3 U$2.27
IN_12_OPEN8: C6.1 IN_12_OPEN8.2 U4.1(IN)
IN_12_SERV: C1.1 IN_12_SERV.2 U1.1(IN)
IN_12_VDD: C5.1 IN_12_VDD.2 U3.1(IN)
IN_IO: C3.1 IN_IO_3V3.2 U2.1(IN)
LEDS_0: LEDS_OPEN8.1 U$3.33
LEDS_1: LEDS_OPEN8.3 U$3.34
LEDS_2: LEDS_OPEN8.5 U$3.31
LEDS_3: LEDS_OPEN8.7 U$3.32
LEDS_4: LEDS_OPEN8.9 U$3.29
LEDS_5: LEDS_OPEN8.11 U$3.30
LEDS_6: LEDS_OPEN8.13 U$3.27
LEDS_7: LEDS_OPEN8.15 U$3.28
LEDS_SERV_0: LEDS_SERV.1 U$1.34
LEDS_SERV_1: LEDS_SERV.3 U$1.31
LEDS_SERV_2: LEDS_SERV.5 U$1.32
LEDS_SERV_3: LEDS_SERV.7 U$1.29
LEDS_SERV_4: LEDS_SERV.9 U$1.30
LEDS_SERV_5: LEDS_SERV.11 U$1.27
LEDS_SERV_6: LEDS_SERV.13 U$1.28
LEDS_SERV_7: LEDS_SERV.15 U$1.25
N$1: R1.2 R3.1 U1.4(FB)
N$2: C2.2 R2.2
N$3: NRESET.2 S19.2(COM)
N$4: IC1.3(GND) R6.2
N$5: C9.1 IC1.2(A) R4.1 Y2.2(CRYSTAL_2)
N$6: R7.2 R10.1 U2.4(FB)
N$7: C4.2 R8.2
N$8: R9.1 R10.2
N$9: C10.2 R18.1 Y2.1(CRYSTAL_1)
N$10: R11.1 S1.1(ON_1)
N$11: R12.1 S2.1(ON_1)
N$12: R13.2 R19.1 U3.4(FB)
N$13: C8.2 R14.2
N$14: IC1.5(VCC) R5.1
N$15: D12.A R88.1
N$16: R22.1 S3.1(ON_1)
N$17: R23.1 S4.1(ON_1)
N$18: R24.1 S5.1(ON_1)
N$19: R25.1 S6.1(ON_1)
N$20: R26.1 S7.1(ON_1)
N$21: R27.1 S8.1(ON_1)
N$22: S5.2(COM) SWITCH_SERV.10
N$23: S6.2(COM) SWITCH_SERV.12
N$24: S7.2(COM) SWITCH_SERV.14
N$25: S8.2(COM) SWITCH_SERV.16
N$26: S4.2(COM) SWITCH_SERV.8
N$27: S3.2(COM) SWITCH_SERV.6
N$28: S2.2(COM) SWITCH_SERV.4
N$29: S1.2(COM) SWITCH_SERV.2
N$30: R15.1 R16.2 U4.4(FB)
N$31: IC2.3(GND) R28.2
N$32: C7.2 R17.2
N$33: C11.1 IC2.2(A) R20.1 Y3.2(CRYSTAL_2)
N$34: C12.2 R29.1 Y3.1(CRYSTAL_1)
N$35: NRESET_SERV.2 S20.2(COM)
N$36: IC2.5(VCC) R21.1
N$37: D1.A R30.1
N$38: D1.C Q1.3(D)
N$39: D2.A R31.1
N$40: D2.C Q2.3(D)
N$41: R81.1 S19.1(ON_1)
N$42: R82.1 S20.1(ON_1)
N$43: D12.C Q11.3(D)
N$44: D3.A R32.1
N$45: D3.C Q14.3(D)
N$46: D4.A R40.1
N$47: D4.C Q3.3(D)
N$48: D5.A R41.1
N$51: D16.A R33.1
N$52: D16.C Q15.3(D)
N$53: D17.A R34.1
N$54: D17.C Q25.3(D)
N$55: D18.A R35.1
N$56: D18.C Q26.3(D)
N$57: D27.A R36.1
N$58: D27.C Q27.3(D)
N$59: D28.A R37.1
N$60: D28.C Q28.3(D)
N$61: D19.A R62.1
N$62: D5.C Q4.3(D)
N$63: D6.A R42.1
N$64: D6.C Q5.3(D)
N$65: D7.A R43.1
N$66: D7.C Q6.3(D)
N$67: D8.A R44.1
N$68: D8.C Q7.3(D)
N$69: D9.A R45.1
N$70: D19.C Q16.3(D)
N$71: D20.A R64.1
N$72: D20.C Q17.3(D)
N$73: D21.A R77.1
N$74: D21.C Q18.3(D)
N$75: D22.A R79.1
N$76: D22.C Q19.3(D)
N$86: D9.C Q8.3(D)
N$94: D10.A R46.1
N$95: D10.C Q9.3(D)
N$96: D11.A R47.1
N$97: D11.C Q10.3(D)
N$105: R66.1 S9.1(ON_1)
N$106: R67.1 S10.1(ON_1)
N$107: R68.1 S11.1(ON_1)
N$108: R69.1 S12.1(ON_1)
N$109: R70.1 S13.1(ON_1)
N$110: R71.1 S14.1(ON_1)
N$111: R89.1 S15.1(ON_1)
N$112: R90.1 S16.1(ON_1)
N$113: S13.2(COM) SWITCH_OPEN8.10
N$114: S14.2(COM) SWITCH_OPEN8.12
N$115: S15.2(COM) SWITCH_OPEN8.14
N$116: S16.2(COM) SWITCH_OPEN8.16
N$117: S12.2(COM) SWITCH_OPEN8.8
N$118: S11.2(COM) SWITCH_OPEN8.6
N$119: S10.2(COM) SWITCH_OPEN8.4
N$120: S9.2(COM) SWITCH_OPEN8.2
NRESET: NRESET.1 U$3.38
NRESET_SERV: NRESET_SERV.1 U$1.35
O_PROG_CIPO: SPI_OPEN8_2.2 U$3.9
O_SPI_COPI: LORA_OPEN8.P$2(MISO) U$2.25
O_SPI_CS: LORA_OPEN8.P$5(NSS) U$2.23
O_SPI_SCK: LORA_OPEN8.P$4(SCK) U$2.28
O_SPIFLASH_COPI: FLASH_OPEN8.10 U$2.18
O_SPIFLASH_CS: FLASH_OPEN8.12 U$2.16
O_SPIFLASH_SCK: FLASH_OPEN8.6 U$2.17
O_TDO: JTAG_OPEN8.13 U$3.5
OPEN8_OUT_0: LEDS_OPEN8.2 Q3.1(G) R48.2
OPEN8_OUT_1: LEDS_OPEN8.4 Q4.1(G) R49.2
OPEN8_OUT_2: LEDS_OPEN8.6 Q5.1(G) R50.2
OPEN8_OUT_3: LEDS_OPEN8.8 Q6.1(G) R51.2
OPEN8_OUT_4: LEDS_OPEN8.10 Q7.1(G) R52.2
OPEN8_OUT_5: LEDS_OPEN8.12 Q8.1(G) R53.2
OPEN8_OUT_6: LEDS_OPEN8.14 Q9.1(G) R54.2
OPEN8_OUT_7: LEDS_OPEN8.16 Q10.1(G) R55.2
OUT_12_OPEN8: C7.1 POWER.1 R15.2 U4.5(OUT)
OUT_12_SERV: C2.1 POWER.3 R3.2 U1.5(OUT)
OUT_12_VDD: C8.1 POWER.5 R19.2 U3.5(OUT)
OUT_IO_3V3: C4.1 POWER.7 R9.2 U2.5(OUT)
RX_IN: U$1.38 USB-UART_OPEN8_1.2
SERV_I_PROG_COPI: SPI_SERV_2.3 U$1.14
SERV_I_PROG_CS: SPI_SERV_2.4 U$1.12
SERV_I_PROG_SCK: SPI_SERV_2.1 U$1.13
SERV_I_SPI_CIPO: LORA_SERV.P$3(MOSI) U$4.16
SERV_I_SPIFLASH_CIPO: FLASH_SERV.8 U$4.26
SERV_I_TCK: JTAG_SERV.9 U$1.9
SERV_I_TDI: JTAG_SERV.5 U$1.10
SERV_I_TMS: JTAG_SERV.7 U$1.8
SERV_I_TRST: JTAG_SERV.3 U$1.5
SERV_O_PROG_CIPO: SPI_SERV_2.2 U$1.11
SERV_O_SPI_COPI: LORA_SERV.P$2(MISO) U$4.13
SERV_O_SPI_CS: LORA_SERV.P$5(NSS) U$4.15
SERV_O_SPI_SCK: LORA_SERV.P$4(SCK) U$1.6
SERV_O_SPIFLASH_COPI: FLASH_SERV.10 U$4.17
SERV_O_SPIFLASH_CS: FLASH_SERV.12 U$4.25
SERV_O_SPIFLASH_SCK: FLASH_SERV.6 U$4.18
SERV_O_TDO: JTAG_SERV.13 U$1.7
SERV_OUT_0: LEDS_SERV.2 Q1.1(G) R38.2
SERV_OUT_1: LEDS_SERV.4 Q2.1(G) R39.2
SERV_OUT_2: LEDS_SERV.6 Q14.1(G) R56.2
SERV_OUT_3: LEDS_SERV.8 Q15.1(G) R57.2
SERV_OUT_4: LEDS_SERV.10 Q25.1(G) R58.2
SERV_OUT_5: LEDS_SERV.12 Q26.1(G) R59.2
SERV_OUT_6: LEDS_SERV.14 Q27.1(G) R60.2
SERV_OUT_7: LEDS_SERV.16 Q28.1(G) R61.2
SERV_RX_IN: U$4.27 USB-UART_SERV_1.2
SERV_TX_OUT: U$4.28 USB-UART_SERV_1.4
SMA_CLK: CLOCK.5 J4.5
TX_OUT: U$2.13 USB-UART_OPEN8_1.4
VDD_3V3: C21.1 C22.1 FLASH_OPEN8.1 FLASH_OPEN8.2 FLASH_SERV.1 FLASH_SERV.2 JTAG_OPEN8.1 JTAG_OPEN8.2 JTAG_SERV.1 JTAG_SERV.2 LORA_OPEN8.P$12(3.3V) LORA_SERV.P$12(3.3V) POWER.8 Q16.1(G) R5.2 R11.2 R12.2 R21.2 R22.2 R23.2 R24.2 R25.2 R26.2 R27.2 R30.2 R31.2 R32.2 R33.2 R34.2 R35.2 R36.2 R37.2 R40.2 R41.2 R42.2 R43.2 R44.2 R45.2 R46.2 R47.2 R62.2 R63.2 R64.2 R66.2 R67.2 R68.2 R69.2 R70.2 R71.2 R77.2 R79.2 R81.2 R82.2 R88.2 R89.2 R90.2 U$1.26 U$2.24 U$3.15 U$3.18 U$4.20 USB-UART_OPEN8_1.3 USB-UART_SERV_1.3
VDD_5V: IN_12_OPEN8.1 IN_12_SERV.1 IN_12_VDD.1 IN_IO_3V3.1 Q11.1(G) R91.2 USB-UART_OPEN8_2.2 USB-UART_SERV_2.2
VO_12_OPEN8: C14.1 C15.1 POWER.2 Q17.1(G) R65.2 U$4.23
VO_12_SERV: C16.1 C17.1 POWER.4 Q18.1(G) R78.2 U$2.19
VO_12_VDD: C19.1 C20.1 POWER.6 Q19.1(G) R80.2 U$1.23 U$2.21 U$3.17 U$3.20 U$4.19
Unconnected: FLASH_OPEN8.5 FLASH_OPEN8.7 FLASH_OPEN8.9 FLASH_OPEN8.11 FLASH_SERV.5 FLASH_SERV.7 FLASH_SERV.9 FLASH_SERV.11 IC1.1(N.C.) IC2.1(N.C.) JTAG_OPEN8.11 JTAG_OPEN8.15 JTAG_OPEN8.17 JTAG_OPEN8.19 JTAG_SERV.11 JTAG_SERV.15 JTAG_SERV.17 JTAG_SERV.19 LORA_OPEN8.P$6(RESET) LORA_OPEN8.P$7(DIO5) LORA_OPEN8.P$9(DIO2) LORA_OPEN8.P$10(DIO1) LORA_OPEN8.P$11(DIO0) LORA_OPEN8.P$13(DIO4) LORA_OPEN8.P$14(DIO3) LORA_OPEN8.P$16(ANT) LORA_SERV.P$6(RESET) LORA_SERV.P$7(DIO5) LORA_SERV.P$9(DIO2) LORA_SERV.P$10(DIO1) LORA_SERV.P$11(DIO0) LORA_SERV.P$13(DIO4) LORA_SERV.P$14(DIO3) LORA_SERV.P$16(ANT) SPI_OPEN8_1.1 SPI_OPEN8_1.2 SPI_OPEN8_1.3 SPI_OPEN8_1.4 SPI_OPEN8_1.5 SPI_OPEN8_1.6 SPI_OPEN8_1.7 SPI_OPEN8_1.8 SPI_OPEN8_1.9 SPI_OPEN8_1.10 SPI_OPEN8_2.5 SPI_OPEN8_2.6 SPI_OPEN8_2.7 SPI_OPEN8_2.8 SPI_OPEN8_2.9 SPI_SERV_1.1 SPI_SERV_1.2 SPI_SERV_1.3 SPI_SERV_1.4 SPI_SERV_1.5 SPI_SERV_1.6 SPI_SERV_1.7 SPI_SERV_1.8 SPI_SERV_1.9 SPI_SERV_1.10 SPI_SERV_2.5 SPI_SERV_2.6 SPI_SERV_2.7 SPI_SERV_2.8 SPI_SERV_2.9 U$1.2 U$1.41 U$2.2 U$2.41 U$3.2 U$3.41 U$4.2 U$4.41 USB-UART_OPEN8_2.1 USB-UART_OPEN8_2.3 USB-UART_OPEN8_2.4 USB-UART_SERV_2.1 USB-UART_SERV_2.3 USB-UART_SERV_2.4

## Notes on the sheet
- CHIP SOCKET
- LORA_SERV
- UART_OPEN8 | JTAG_OPEN8
- SPI_SERV
- JTAG_SERV
- FLASH_SERV
- FLASH_OPEN8
- LEDS_SERV
- UART_SERV
- SPI_OPEN8
- LORA_OPEN8
- SWITCH_OPEN8
- POWER
- Regulator - 5V to 1.2V
- LEDS_OPEn8
- SWITCH_SERV
- CLOCK GENERATOR
- SMA
- 8MHZ
- 32KHZ
- Mounting holes
- RESET

## Library data of the parts
C1 C3 C5 C6 = SparkFun-Capacitors:1.0UF: 1µF ceramic capacitors A capacitor is a passive two-terminal electrical component used to store electrical energy temporarily in an electric field.; PROD_ID: CAP-00868
C2 C4 C7 C8 = SparkFun-Capacitors:4.7UF: 4.7µF ceramic capacitors A capacitor is a passive two-terminal electrical component used to store electrical energy temporarily in an electric field.; PROD_ID: CAP-08280
C9 C10 = SparkFun-Capacitors:22PF: 22pF ceramic capacitors A capacitor is a passive two-terminal electrical component used to store electrical energy temporarily in an electric field.; PROD_ID: CAP-07876; VALUE: 22pF
C11 C12 = SparkFun-Capacitors:22PF: 22pF ceramic capacitors A capacitor is a passive two-terminal electrical component used to store electrical energy temporarily in an electric field.; PROD_ID: CAP-07876
C14 C16 C19 C21 = SparkFun-Capacitors:0.1UF: 0.1µF ceramic capacitors A capacitor is a passive two-terminal electrical component used to store electrical energy temporarily in an electric field.; PROD_ID: CAP-08604
C15 C17 C20 C22 = SparkFun-Capacitors:10UF: 10.0µF ceramic capacitors A capacitor is a passive two-terminal electrical component used to store electrical energy temporarily in an electric field.; PROD_ID: CAP-11015
CLOCK GND = Connector:PINHD-2X3: PIN HEADER; CATEGORY: CONNECTOR; SUB-CATEGORY: PIN-HEADER
D1-D12 D16-D22 D27 D28 = SparkFun-LED:LED: LED (Generic) Standard schematic elements and footprints for 5mm, 3mm, 1206, and 0603 sized LEDs. Generic LEDs with no color specified.
FLASH_OPEN8 FLASH_SERV = Connector:PINHD-2X6: PIN HEADER; CATEGORY: CONNECTOR; SUB-CATEGORY: PIN-HEADER
H1-H4 = holes:MOUNT-HOLE: MOUNTING HOLE with drill center marker
IC1 IC2 = SamacSys_Parts:SN74LVC1GU04DBVR: Single Inverter Gate Source: Datasheet <http://www.ti.com/lit/ds/symlink/sn74lvc1gu04.pdf>; ARROW_PART_NUMBER: SN74LVC1GU04DBVR; ARROW_PRICE-STOCK: https://www.arrow.com/en/products/sn74lvc1gu04dbvr/texas-instruments?region=nac; DESCRIPTION: Single Inverter Gate; HEIGHT: 1.45mm; MANUFACTURER_NAME: Texas Instruments; MANUFACTURER_PART_NUMBER: SN74LVC1GU04DBVR; MOUSER_PART_NUMBER: 595-SN74LVC1GU04DBVR; MOUSER_PRICE-STOCK: https://www.mouser.co.uk/ProductDetail/Texas-Instruments/SN74LVC1GU04DBVR?qs=xJkDX%2FqrskOXGoPUy6IENA%3D%3D
IN_12_OPEN8 IN_12_SERV IN_12_VDD IN_IO_3V3 NRESET NRESET_SERV = jumper:JP1Q: JUMPER
J4 = SamacSys_Parts:2985-6004: RF Connectors / Coaxial Connectors SMA F PCB Thru-Hole Conn, 50-OHMS 1000 Source: Datasheet <https://componentsearchengine.com//2985-6004.pdf>; DESCRIPTION: RF Connectors / Coaxial Connectors SMA F PCB Thru-Hole Conn, 50-OHMS 1000; HEIGHT: 9.54mm; MANUFACTURER_NAME: Amphenol; MANUFACTURER_PART_NUMBER: 2985-6004; MOUSER_PART_NUMBER: 523-2985-6004; MOUSER_PRICE-STOCK: https://www.mouser.co.uk/ProductDetail/Amphenol-SV-Microwave/2985-6004?qs=jyo2EwfRkUNkt8LGijRXFQ%3D%3D
JTAG_OPEN8 JTAG_SERV = pinhead:PINHD-2X10: PIN HEADER
LEDS_OPEN8 LEDS_SERV SWITCH_OPEN8 SWITCH_SERV = pinhead:PINHD-2X8: PIN HEADER
LORA_OPEN8 LORA_SERV = qfp160:RFM95W-915S2
POWER = Connector:PINHD-2X4: PIN HEADER; CATEGORY: CONNECTOR; SUB-CATEGORY: PIN-HEADER
Q1-Q11 Q14-Q19 Q25-Q28 = SamacSys_Parts:BSH103,235: MOSFET TAPE13 MOSFET Source: Datasheet <http://www.nxp.com/documents/data_sheet/BSH103.pdf>; DESCRIPTION: MOSFET TAPE13 MOSFET; HEIGHT: 1.1mm; MANUFACTURER_NAME: Nexperia; MANUFACTURER_PART_NUMBER: BSH103,235; MOUSER_PART_NUMBER: 771-BSH103235; MOUSER_PRICE-STOCK: https://www.mouser.co.uk/ProductDetail/Nexperia/BSH103235?qs=me8TqzrmIYVhbJIwsR7ziw%3D%3D
R1 R7 R13 R16 = SparkFun-Resistors:62KOHM: 62kΩ resistor A resistor is a passive two-terminal electrical component that implements electrical resistance as a circuit element. Resistors act to reduce current flow, and, at the same time, act to lower voltage levels within circuits. - Wikipedia
R2 R8 R14 R17 = SparkFun-Resistors:1OHM: 1Ω resistor A resistor is a passive two-terminal electrical component that implements electrical resistance as a circuit element. Resistors act to reduce current flow, and, at the same time, act to lower voltage levels within circuits. - Wikipedia; PROD_ID: RES-08269
R3 R15 R19 = SparkFun-Resistors:43KOHM: 43kΩ resistor A resistor is a passive two-terminal electrical component that implements electrical resistance as a circuit element. Resistors act to reduce current flow, and, at the same time, act to lower voltage levels within circuits. - Wikipedia; PROD_ID: RES-07858; VALUE: 43k
R4-R6 R18 R20 R21 R28 R29 = SparkFun-Resistors:22MOHM: 22MΩ resistor A resistor is a passive two-terminal electrical component that implements electrical resistance as a circuit element. Resistors act to reduce current flow, and, at the same time, act to lower voltage levels within circuits. - Wikipedia; PROD_ID: RES-11132; VALUE: 22M
R9 = SparkFun-Resistors:26.7KOHM: 26.7kΩ resistor A resistor is a passive two-terminal electrical component that implements electrical resistance as a circuit element. Resistors act to reduce current flow, and, at the same time, act to lower voltage levels within circuits. - Wikipedia; PROD_ID: RES-12186; VALUE: 26.7k
R10 = SparkFun-Resistors:220KOHM: 220kΩ resistor A resistor is a passive two-terminal electrical component that implements electrical resistance as a circuit element. Resistors act to reduce current flow, and, at the same time, act to lower voltage levels within circuits. - Wikipedia; PROD_ID: RES-08969; VALUE: 220k
R11 R12 R22-R27 R38 R39 R48-R61 R63 R65-R71 R78 R80-R82 R89-R91 = SparkFun-Resistors:10KOHM: 10kΩ resistor A resistor is a passive two-terminal electrical component that implements electrical resistance as a circuit element. Resistors act to reduce current flow, and, at the same time, act to lower voltage levels within circuits. - Wikipedia; PROD_ID: RES-00824
R30-R37 R40-R47 R62 R64 R77 R79 R88 = SparkFun-Resistors:330OHM: 330Ω resistor A resistor is a passive two-terminal electrical component that implements electrical resistance as a circuit element. Resistors act to reduce current flow, and, at the same time, act to lower voltage levels within circuits. - Wikipedia; PROD_ID: RES-00818
S1-S16 S19 S20 = SamacSys_Parts:SS12SDP2: Switch, Slide,Sub Miniature,Top Actuated,SPDT, On-none-On Source: Datasheet; DESCRIPTION: Switch, Slide,Sub Miniature,Top Actuated,SPDT, On-none-On; HEIGHT: 4mm; MANUFACTURER_NAME: NKK Switches; MANUFACTURER_PART_NUMBER: SS12SDP2; MOUSER_PART_NUMBER: 633-SS12SDP2; MOUSER_PRICE-STOCK: https://www.mouser.co.uk/ProductDetail/NKK-Switches/SS12SDP2?qs=Av7JdS0MGqKsG%252BWOKKtU2w%3D%3D
SPI_OPEN8_1 SPI_OPEN8_2 SPI_SERV_1 SPI_SERV_2 = con-lsta:FE10-1: FEMALE HEADER; OC_FARNELL: unknown; OC_NEWARK: unknown
U1-U4 = TPS76201DBVR:TPS76201DBVR: Check prices <https://pricing.snapeda.com/parts/TPS76201DBVR/Texas%20Instruments/view-part?ref=eda>; AVAILABILITY: In Stock; DESCRIPTION: 100-mA, 10-V, low-IQ, adjustable low-dropout voltage regulator with enable 5-SOT-23 -40 to 125; MF: Texas Instruments; MP: TPS76201DBVR; PACKAGE: SOT-23-5 Texas Instruments; PRICE: None; PURCHASE-URL: https://pricing.snapeda.com/search/part/TPS76201DBVR/?ref=eda
U$1-U$4 = Duy:2X41_HEADER
USB-UART_OPEN8_1 USB-UART_OPEN8_2 USB-UART_SERV_1 USB-UART_SERV_2 = Connector:PINHD-1X4: PIN HEADER; CATEGORY: CONNECTOR; SUB-CATEGORY: PIN-HEADER
Y2 = SamacSys_Parts:HC-49SM8MHZ20PF30PPM: Crystal Source: Datasheet <https://datasheet.lcsc.com/szlcsc/Zhejiang-Abel-Elec-HC-49SM8MHz20pF30ppm_C107426.pdf>; DESCRIPTION: Crystal; HEIGHT: 4mm; MANUFACTURER_NAME: TAE(Zhejiang Abel Elec); MANUFACTURER_PART_NUMBER: HC-49SM8MHz20pF30ppm
Y3 = SamacSys_Parts:Q13FC1350000400: SMD Crystal Resonators 32.768KHz +/-20ppm SMD-3215_2P RoHS Source: Datasheet <https://datasheet.lcsc.com/szlcsc/1901081604_Seiko-Epson-Q13FC1350000400_C32346.pdf>; DESCRIPTION: SMD Crystal Resonators 32.768KHz +/-20ppm SMD-3215_2P RoHS; HEIGHT: 0.9mm; MANUFACTURER_NAME: SEIKO EPSON; MANUFACTURER_PART_NUMBER: Q13FC1350000400